# EAGLE design myStravaB_V2 (EAGLE 9.2.2)

## Sheet 1 of 5: MCU
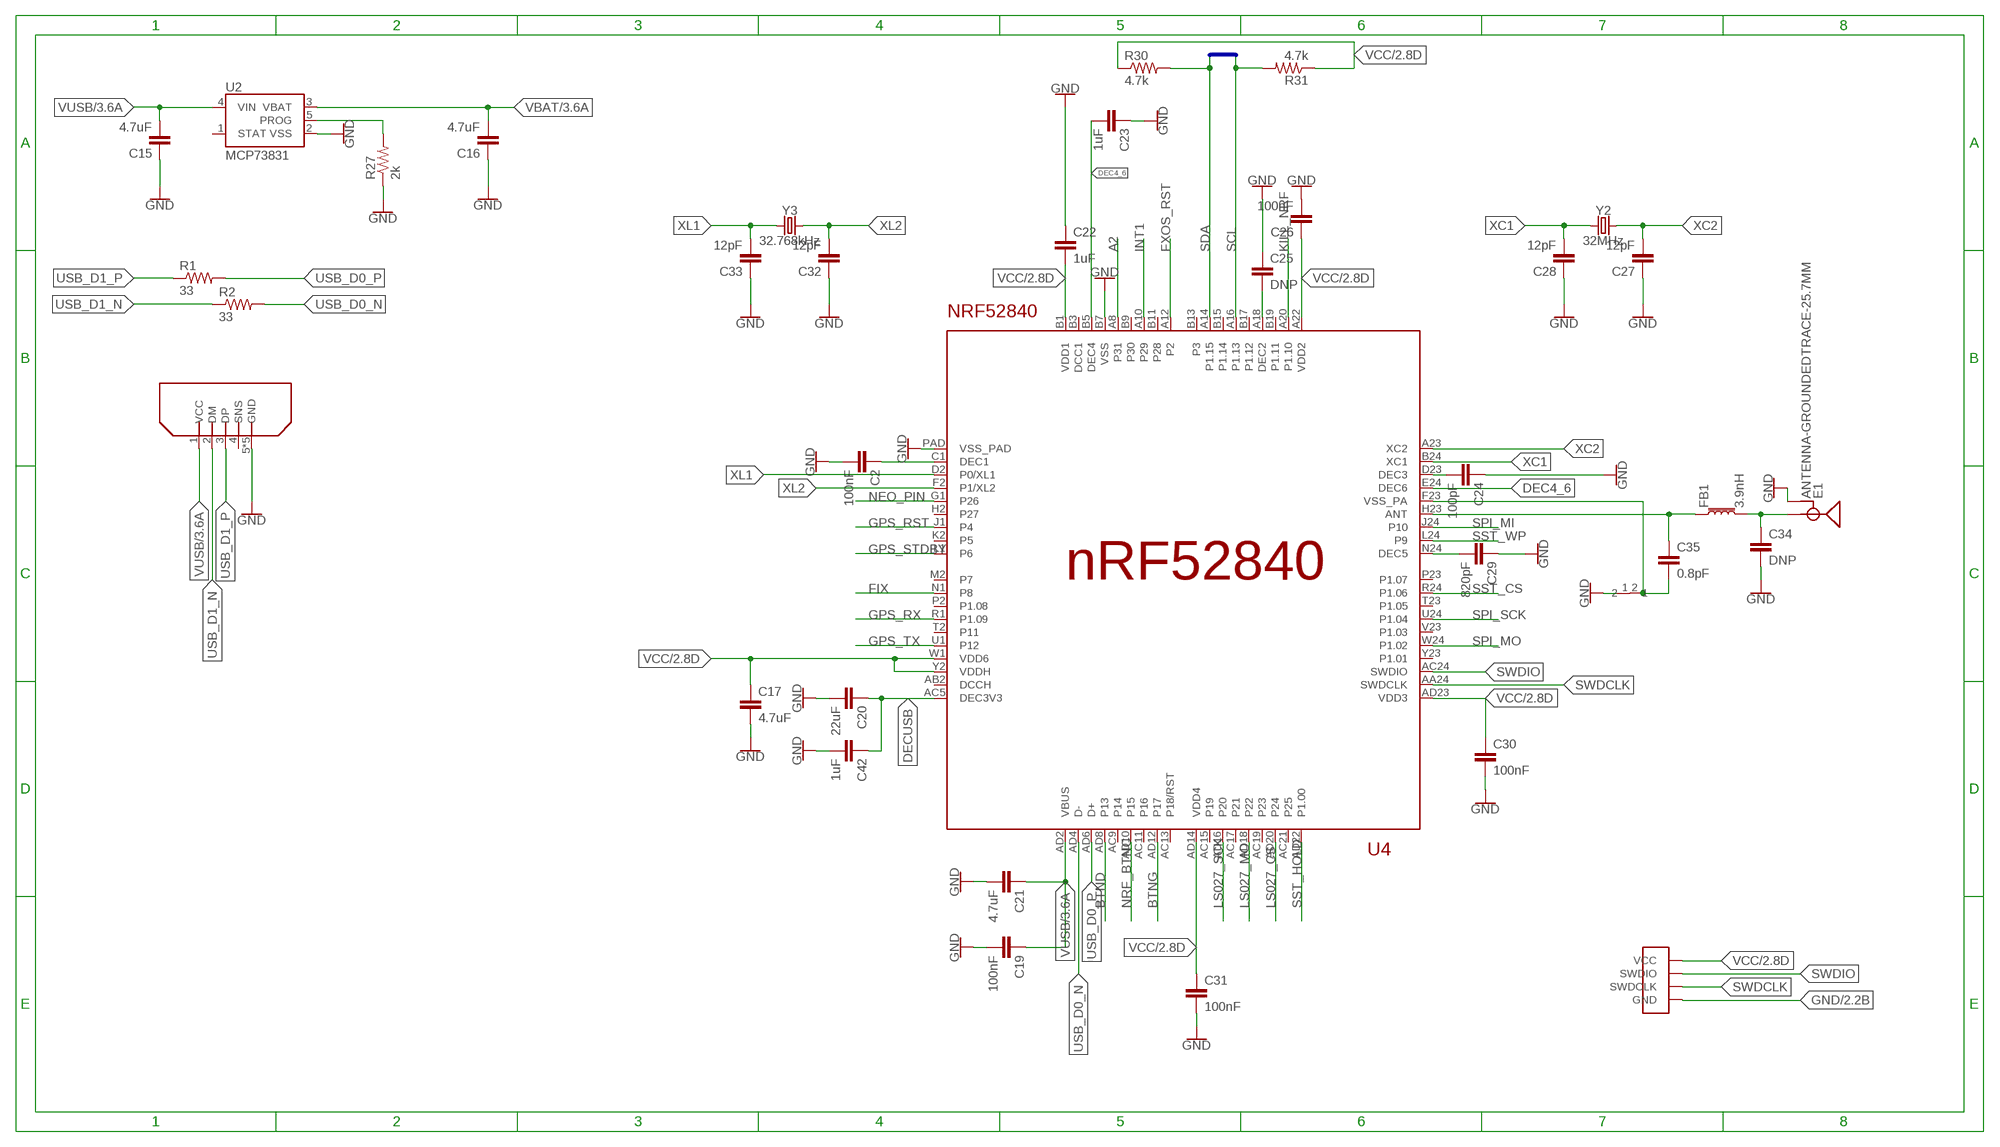
[diagram p0: schematic, sheet 1]

### Parts
C2  100nF  C-EUC0603  [C0603]
C15  4.7uF  C-EUC0805  [C0805]
C16  4.7uF  C-EUC0805  [C0805]
C17  4.7uF  C-EUC0603  [C0603]
C19  100nF  C-EUC0603  [C0603]
C20  22uF  C-EUC0603  [C0603]
C21  4.7uF  C-EUC0805  [C0805]
C22  1uF  4.7UF0603  [0603]
C23  1uF  4.7UF0603  [0603]
C24  100pF  C-EUC0603  [C0603]
C25  DNP  C-EUC0402  [C0402]
C26  100nF  C-EUC0603  [C0603]
C27  12pF  C-EUC0402  [C0402]
C28  12pF  C-EUC0402  [C0402]
C29  820pF  C-EUC0603  [C0603]
C30  100nF  C-EUC0402  [C0402]
C31  100nF  C-EUC0402  [C0402]
C32  12pF  C-EUC0603  [C0603]
C33  12pF  C-EUC0603  [C0603]
C34  DNP  4.7UF0603  [0603]
C35  0.8pF  C-EUC0402  [C0402]
C42  1uF  C-EUC0603  [C0603]
E1  ANTENNA-GROUNDEDTRACE-25.7MM  [TRACE_ANTENNA_2.4GHZ_25.7MM]
FB1  3.9nH  FERRITE_BEAD-0603  [0603]
R1  33  R-US_R0603  [R0603]
R2  33  R-US_R0603  [R0603]
R27  2k  R-US_R0603  [R0603]
R30  4.7k  R-US_R0603  [R0603]
R31  4.7k  R-US_R0603  [R0603]
U2  MCP73831  [SOT23-5]
U4  NRF52840  [AQFN73]
U$3  ZX80B5P  [ZX80B5P]
U$7  PROG_SMD  [PROG_SMD]
U$8  NET_CONN  [NET_CONN]
Y2  32MHz  CRYSTAL-16MHZSMD-5X3.2  [CRYSTAL-SMD-5X3.2-4PAD]
Y3  32.768kHz  CRYSTAL-32.768KHZSMD-3.2X1.5  [CRYSTAL-SMD-3.2X1.5MM]

### Nets
A2: U4.A8(P31)
BTND: U4.AD8(P13) ; also sheet 2
BTNG: U4.AD12(P17) ; also sheet 2
DEC1: C2.1 U4.C1(DEC1)
DEC2: C25.2 U4.A18(DEC2)
DEC3: C24.2 U4.D23(DEC3)
DEC4_6: C23.2 U4.B5(DEC4) U4.E24(DEC6)
DEC5: C29.2 U4.N24(DEC5)
DECUSB: C20.1 C42.1 U4.AC5(DEC3V3)
FIX: U4.N1(P8) ; also sheet 4
FXOS_RST: U4.A12(P2) ; also sheet 2
GND [power]: C2.2 C15.1 C16.1 C17.2 C19.2 C20.2 C21.2 C22.1 C23.1 C24.1 C25.1 C26.2 C27.1 C28.1 C29.1 C30.2 C31.2 C32.1 C33.1 C34.2 C42.2 E1.GND E1.GND2(GND) R27.1 U2.2(VSS) U4.B7(VSS) U4.PAD(VSS_PAD) U$3.5(GND) U$3.GND1(GND) U$3.GND2(GND) U$3.GND3(GND) U$3.GND4(GND) U$7.GND U$8.1 ; also sheet 2,3,4,5
GPS_RST: U4.J1(P4) ; also sheet 4
GPS_RX: U4.R1(P1.09) ; also sheet 4
GPS_STDBY: U4.L1(P6) ; also sheet 4
GPS_TX: U4.U1(P12) ; also sheet 4
INT1: U4.A10(P29) ; also sheet 2
KILL_NRF: U4.A20(P1.10) ; also sheet 3
LS027_CS: U4.AD20(P24) ; also sheet 5
LS027_MO: U4.AD18(P22) ; also sheet 5
LS027_SCK: U4.AD16(P20) ; also sheet 5
N$3 [RF]: C35.1 FB1.1 U4.H23(ANT)
N$7 [RF]: C34.1 E1.ANT(SIGNAL) FB1.2
N$10 [power]: C35.2 U4.F23(VSS_PA) U$8.2
N$13: R27.2 U2.5(PROG)
NEO_PIN: U4.G1(P26) ; also sheet 5
NRF_BTNC: U4.AD10(P15) ; also sheet 3
SCL: R31.2 U4.A16(P1.13) ; also sheet 2,3,5
SDA: R30.2 U4.A14(P1.15) ; also sheet 2,3,5
SPI_MI: U4.J24(P10) ; also sheet 2
SPI_MO: U4.W24(P1.02) ; also sheet 2
SPI_SCK: U4.U24(P1.04) ; also sheet 2
SST_CS: U4.R24(P1.06) ; also sheet 2
SST_HOLD: U4.AD22(P1.00) ; also sheet 2
SST_WP: U4.L24(P9) ; also sheet 2
SWDCLK: U4.AA24(SWDCLK) U$7.PIN1(SWDCLK)
SWDIO: U4.AC24(SWDIO) U$7.PIN2(SWDIO)
USB_D0_N [usb]: R2.2 U4.AD4(D-)
USB_D0_P [usb]: R1.2 U4.AD6(D+)
USB_D1_N [usb]: R2.1 U$3.2(DM)
USB_D1_P [usb]: R1.1 U$3.3(DP)
VBAT [power]: C16.2 U2.3(VBAT) ; also sheet 3,4
VCC [power]: C17.1 C22.2 C26.1 C30.1 C31.1 R30.1 R31.1 U4.A22(VDD2) U4.AD14(VDD4) U4.AD23(VDD3) U4.B1(VDD1) U4.W1(VDD6) U4.Y2(VDDH) U$7.VCC ; also sheet 2,3,4,5
VUSB [power]: C15.2 C19.1 C21.1 U2.4(VIN) U4.AD2(VBUS) U$3.1(VCC) ; also sheet 3
XC1: C28.2 U4.B24(XC1) Y2.1
XC2: C27.2 U4.A23(XC2) Y2.3
XL1: C33.2 U4.D2(P0/XL1) Y3.P$1
XL2: C32.2 U4.F2(P1/XL2) Y3.P$2
Unconnected: U2.1(STAT) U4.AB2(DCCH) U4.AC9(P14) U4.AC11(P16) U4.AC13(P18/RST) U4.AC15(P19) U4.AC17(P21) U4.AC19(P23) U4.AC21(P25) U4.B3(DCC1) U4.B9(P30) U4.B11(P28) U4.B13(P3) U4.B15(P1.14) U4.B17(P1.12) U4.B19(P1.11) U4.H2(P27) U4.K2(P5) U4.M2(P7) U4.P2(P1.08) U4.P23(P1.07) U4.T2(P11) U4.T23(P1.05) U4.V23(P1.03) U4.Y23(P1.01) U$3.4(SNS)

### Buses
SDA,SCL

## Sheet 2 of 5: Memory
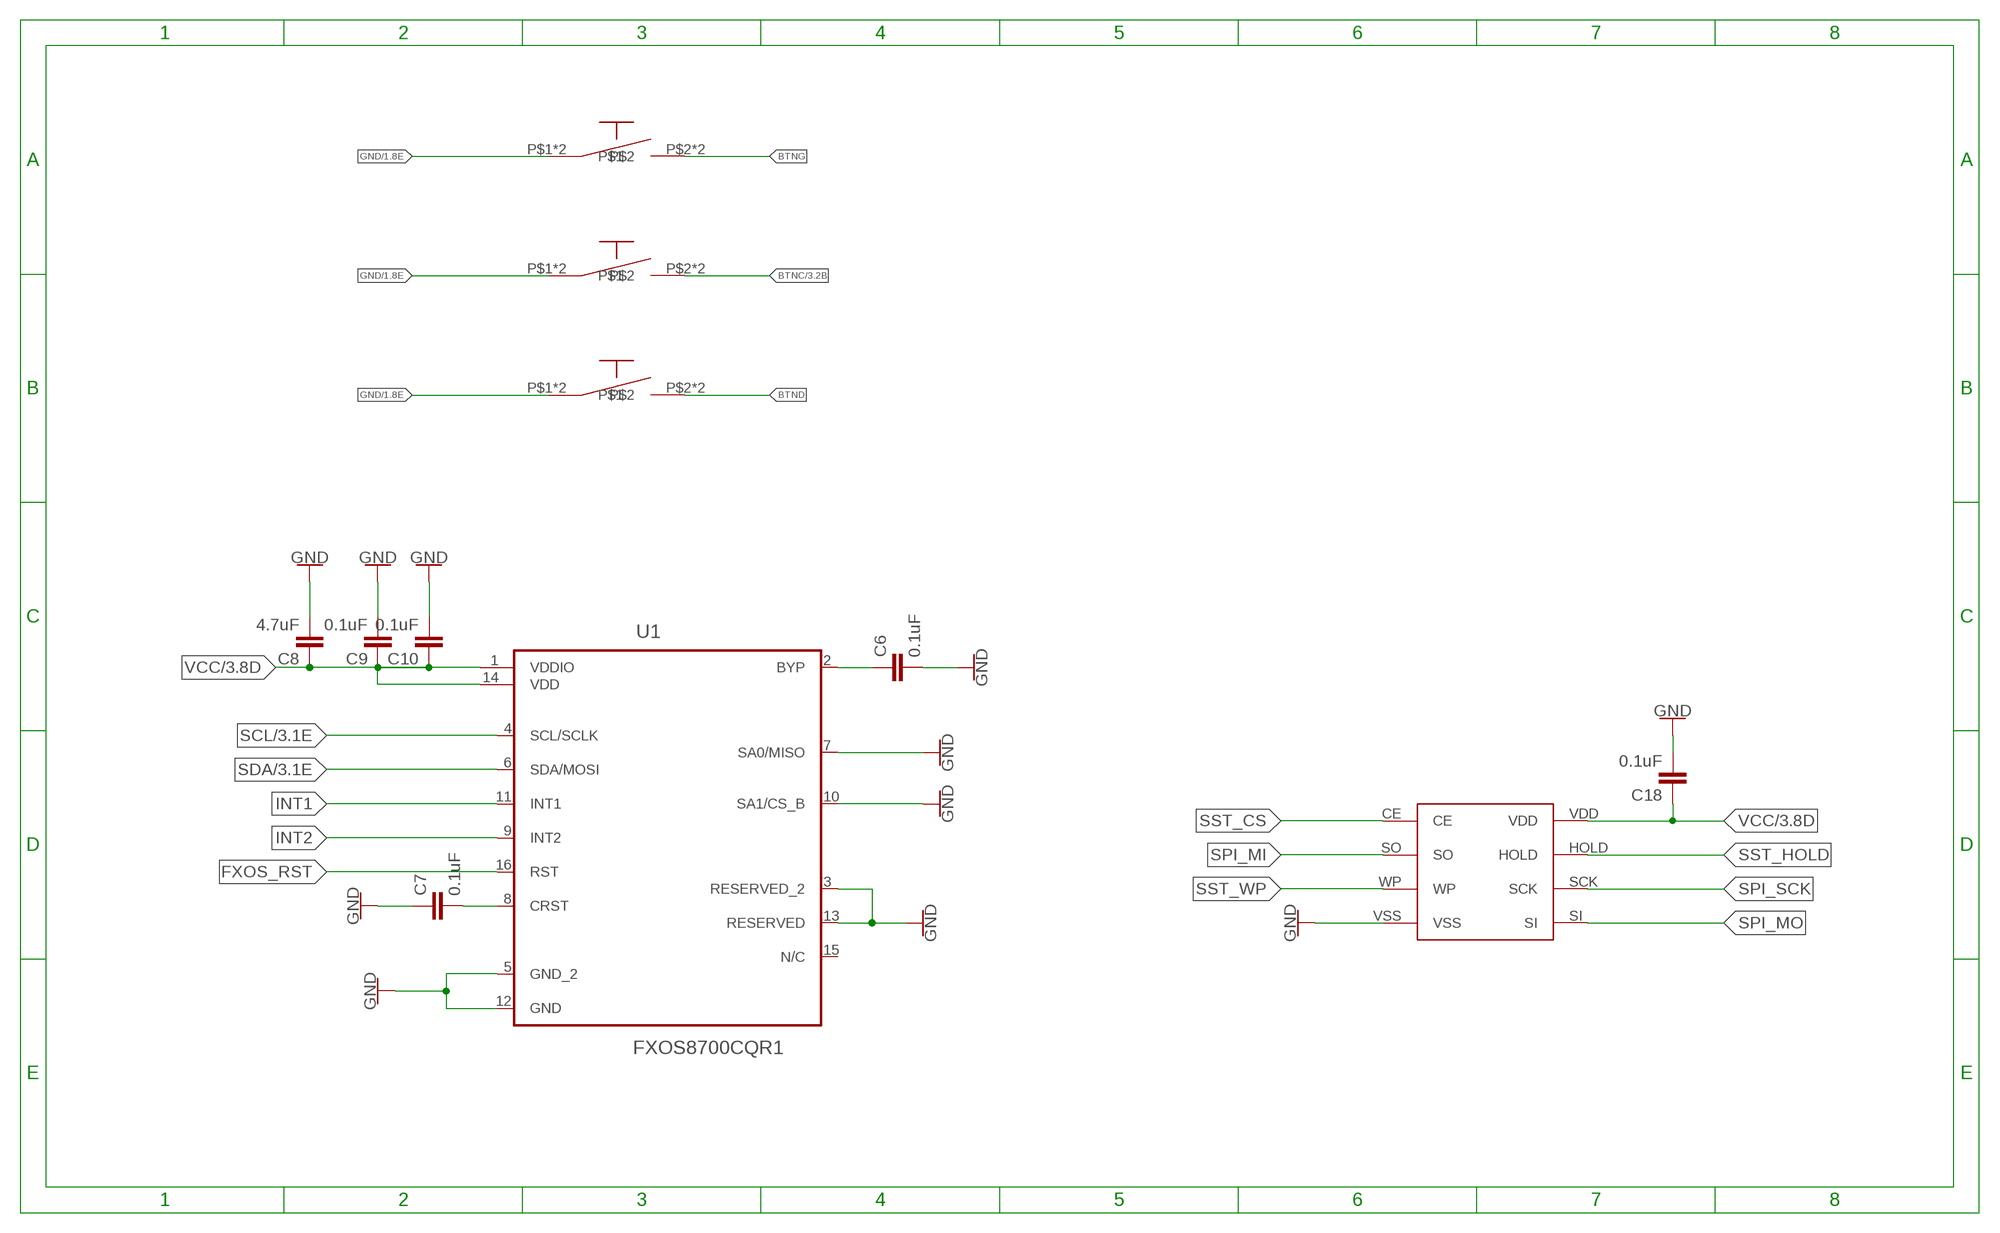
[diagram p1: schematic, sheet 2]

### Parts
BTNC1  SKRMAAE010  [SKRMAAE010]
BTND1  SKRMAAE010  [SKRMAAE010]
BTNG1  SKRMAAE010  [SKRMAAE010]
C6  0.1uF  4.7UF0603  [0603]
C7  0.1uF  4.7UF0603  [0603]
C8  4.7uF  4.7UF0603  [0603]
C9  0.1uF  4.7UF0603  [0603]
C10  0.1uF  4.7UF0603  [0603]
C18  0.1uF  4.7UF0603  [0603]
U1  FXOS8700CQR1  [QFN50P300X300X120-16N]
U$2  FLASH  [SOIC8]

### Nets
BTNC: BTNC1.P$2 BTNC1.P$4 ; also sheet 3
BTND: BTND1.P$2 BTND1.P$4 ; also sheet 1
BTNG: BTNG1.P$2 BTNG1.P$4 ; also sheet 1
BYP: C6.1 U1.2(BYP)
CRST: C7.2 U1.8(CRST)
FXOS_RST: U1.16(RST) ; also sheet 1
GND [power]: BTNC1.P$1 BTNC1.P$3 BTND1.P$1 BTND1.P$3 BTNG1.P$1 BTNG1.P$3 C6.2 C7.1 C8.2 C9.2 C10.2 C18.2 U1.3(RESERVED_2) U1.5(GND_2) U1.7(SA0/MISO) U1.10(SA1/CS_B) U1.12(GND) U1.13(RESERVED) U$2.VSS ; also sheet 1,3,4,5
INT1: U1.11(INT1) ; also sheet 1
INT2: U1.9(INT2)
SCL: U1.4(SCL/SCLK) ; also sheet 1,3,5
SDA: U1.6(SDA/MOSI) ; also sheet 1,3,5
SPI_MI: U$2.SO ; also sheet 1
SPI_MO: U$2.SI ; also sheet 1
SPI_SCK: U$2.SCK ; also sheet 1
SST_CS: U$2.CE ; also sheet 1
SST_HOLD: U$2.HOLD ; also sheet 1
SST_WP: U$2.WP ; also sheet 1
VCC [power]: C8.1 C9.1 C10.1 C18.1 U1.1(VDDIO) U1.14(VDD) U$2.VDD ; also sheet 1,3,4,5
Unconnected: U1.15(N/C)

## Sheet 3 of 5: Power
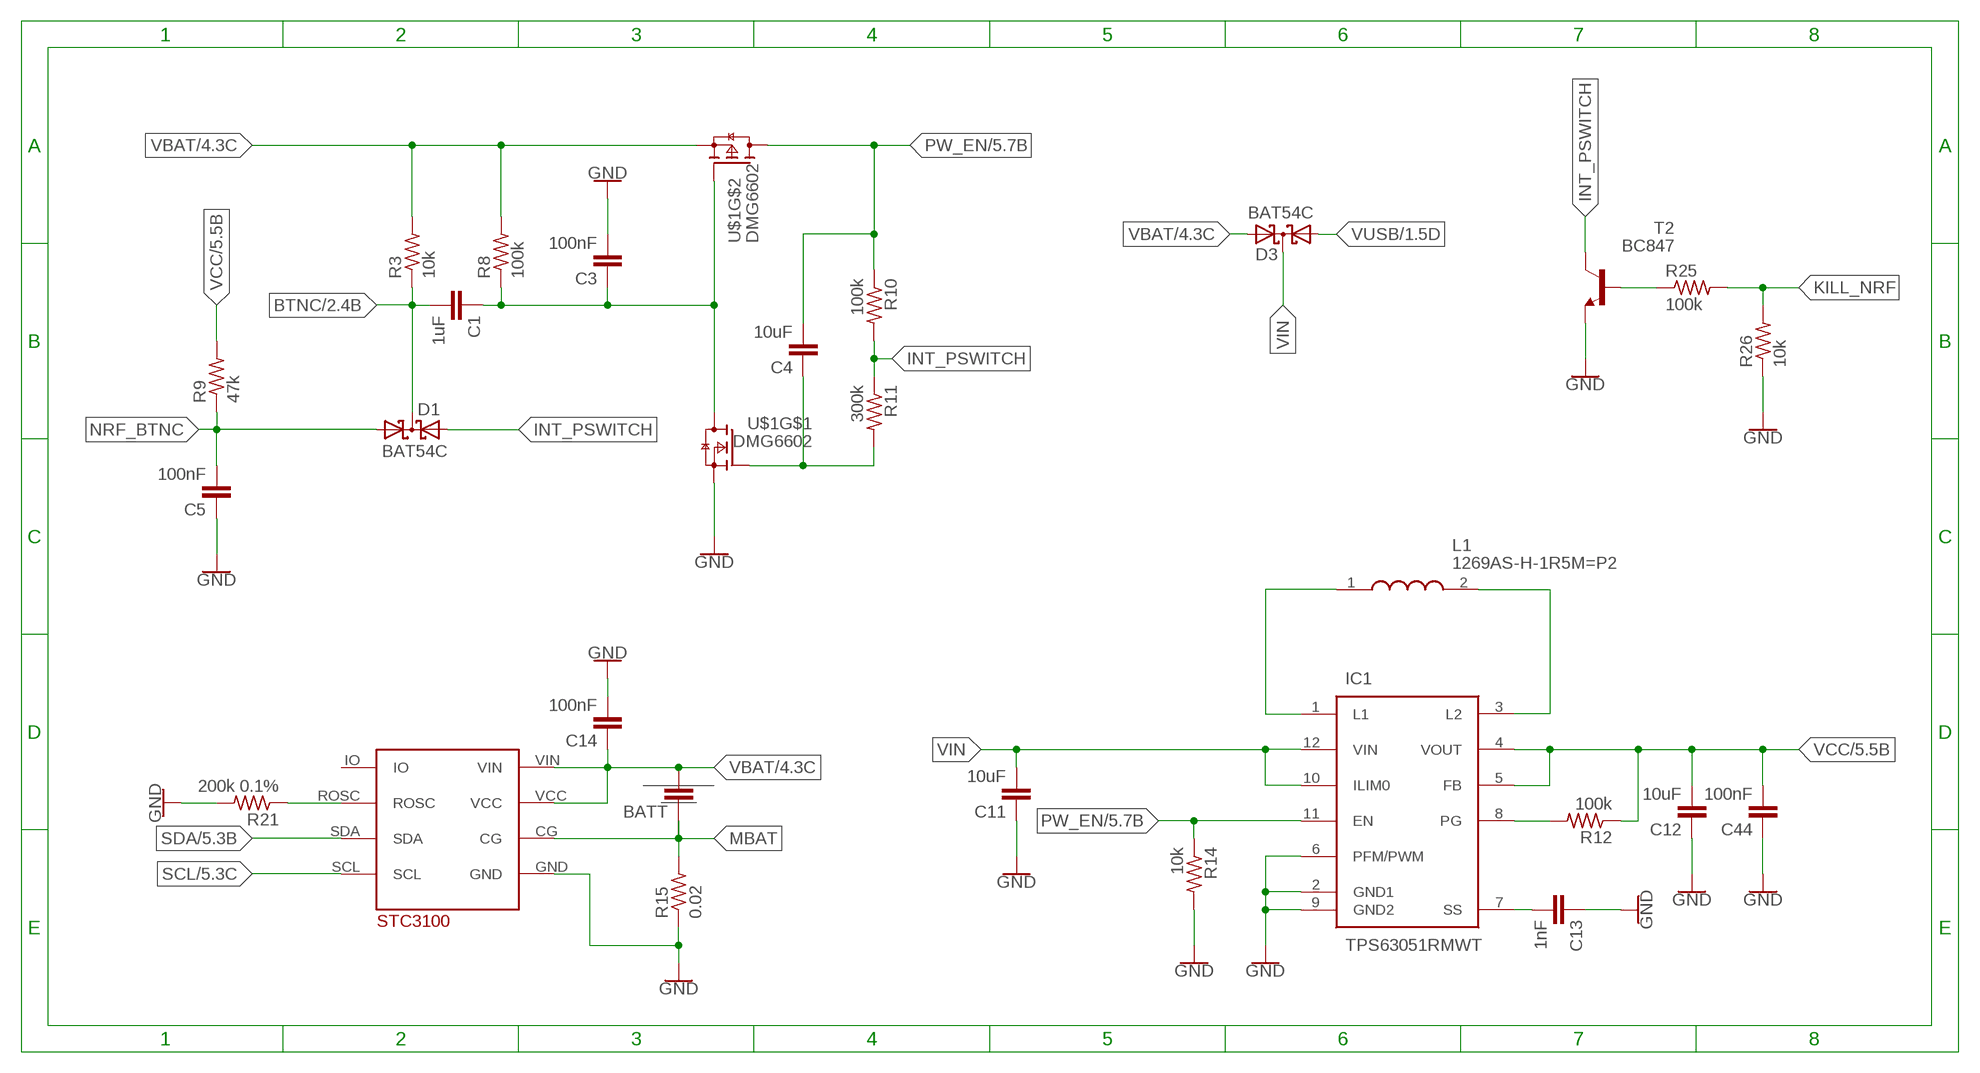
[diagram p2: schematic, sheet 3]

### Parts
BATT  C-EUC1210  [C1210]
C1  1uF  4.7UF0603  [0603]
C3  100nF  4.7UF0603  [0603]
C4  10uF  4.7UF0603  [0603]
C5  100nF  4.7UF0603  [0603]
C11  10uF  C-EUC0805  [C0805]
C12  10uF  C-EUC0603  [C0603]
C13  1nF  C-EUC0603  [C0603]
C14  100nF  C-EUC0603  [C0603]
C44  100nF  C-EUC0603  [C0603]
D1  BAT54C  [SOT23]
D3  BAT54C  [SOT23]
IC1  TPS63051RMWT  [QFN50P250X250X100-12N]
L1  1269AS-H-1R5M=P2  [INDC2520X110N]
R3  10k  R-US_R0603  [R0603]
R8  100k  R-US_R0603  [R0603]
R9  47k  R-US_R0603  [R0603]
R10  100k  R-US_R0603  [R0603]
R11  300k  R-US_R0603  [R0603]
R12  100k  R-US_R0603  [R0603]
R14  10k  R-US_R0603  [R0603]
R15  0.02  R-US_R0603  [R0603]
R21  200k 0.1%  R-US_R0603  [R0603]
R25  100k  R-US_R0603  [R0603]
R26  10k  R-US_R0603  [R0603]
T2  BC847  [SOT23]
U$1  DMG6602  [TSOT26]
U$6  STC3100  [STC3100]

### Nets
BTNC: C1.2 D1.3(CC) R3.1 ; also sheet 2
GND [power]: C3.2 C5.1 C11.1 C12.1 C13.1 C14.2 C44.1 IC1.2(GND1) IC1.6(PFM/PWM) IC1.9(GND2) R14.2 R15.1 R21.2 R26.1 T2.2(E) U$1.P$5(S) U$6.GND ; also sheet 1,2,4,5
INT_PSWITCH: D1.2(A2) R10.2 R11.1 T2.3(C)
KILL_NRF: R25.2 R26.2 ; also sheet 1
L1: IC1.1(L1) L1.1
L2: IC1.3(L2) L1.2
MBAT: BATT.1 R15.2 U$6.CG
N$9: C1.1 C3.1 R8.1 U$1.P$3(G) U$1.P$6(D)
N$12: R25.1 T2.1(B)
N$15: C4.1 R11.2 U$1.P$1(G)
NRF_BTNC: C5.2 D1.1(A1) R9.1 ; also sheet 1
PG: IC1.8(PG) R12.2
PW_EN: C4.2 IC1.11(EN) R10.1 R14.1 U$1.P$4(D) ; also sheet 5
ROSC: R21.1 U$6.ROSC
SCL: U$6.SCL ; also sheet 1,2,5
SDA: U$6.SDA ; also sheet 1,2,5
SS: C13.2 IC1.7(SS)
VBAT [power]: BATT.2 C14.1 D3.2(A2) R3.2 R8.2 U$1.P$2(S) U$6.VCC U$6.VIN ; also sheet 1,4
VCC [power]: C12.2 C44.2 IC1.4(VOUT) IC1.5(FB) R9.2 R12.1 ; also sheet 1,2,4,5
VIN: C11.2 D3.3(CC) IC1.10(ILIM0) IC1.12(VIN)
VUSB [power]: D3.1(A1) ; also sheet 1
Unconnected: U$6.IO

## Sheet 4 of 5: GPS
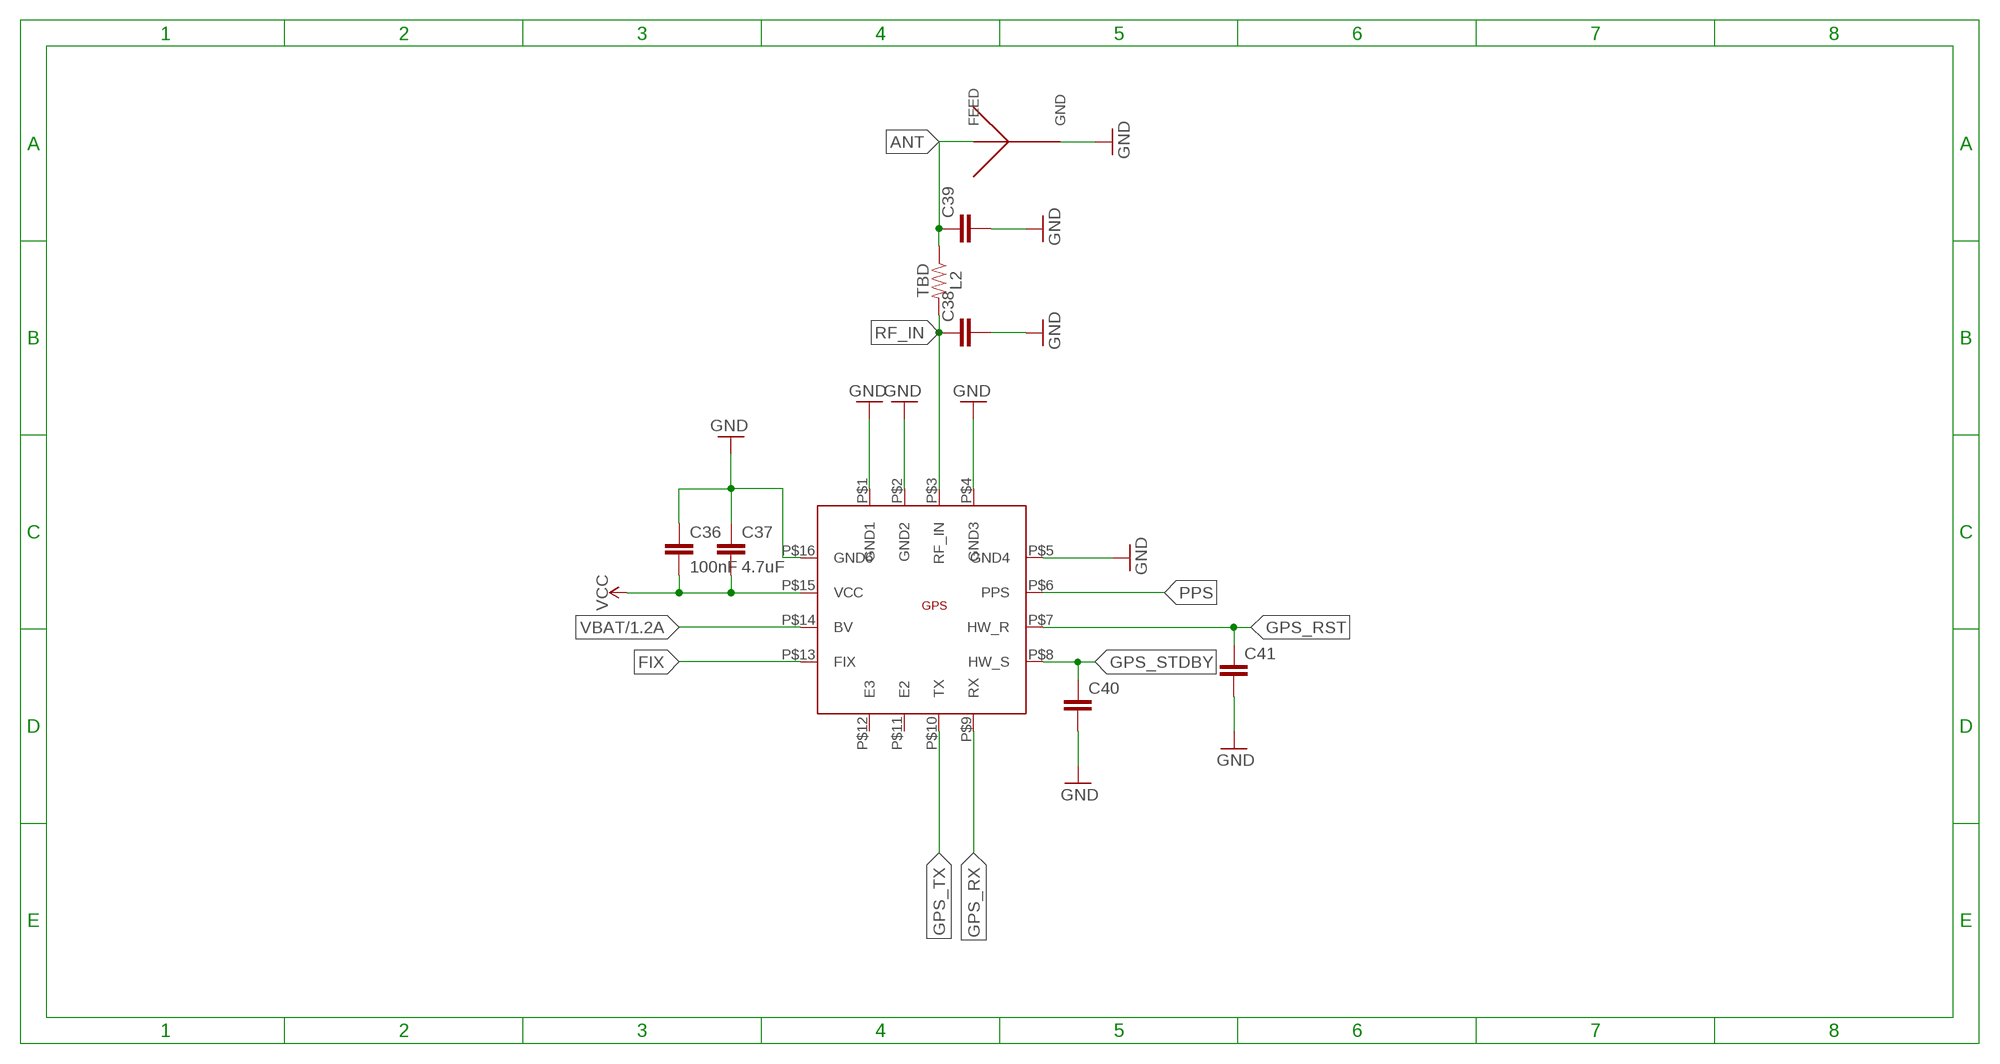
[diagram p3: schematic, sheet 4]

### Parts
C36  100nF  C-EUC0603  [C0603]
C37  4.7uF  C-EUC0603  [C0603]
C38  C-EUC0603  [C0603]
C39  C-EUC0603  [C0603]
C40  C-EUC0603  [C0603]
C41  C-EUC0603  [C0603]
L2  TBD  4.7KOHM-0603-1/10W-1%  [0603]
U$4  SR4G008  [SR4G008]
U$5  M10578  [M10578]

### Nets
ANT [RF]: C39.1 L2.1 U$4.P$2(FEED)
FIX: U$5.P$13(FIX) ; also sheet 1
GND [power]: C36.1 C37.1 C38.2 C39.2 C40.2 C41.2 U$4.P$3(GND) U$4.P$4(GND) U$4.P$6(GND) U$5.P$1(GND1) U$5.P$2(GND2) U$5.P$4(GND3) U$5.P$5(GND4) U$5.P$16(GND6) ; also sheet 1,2,3,5
GPS_RST: C41.1 U$5.P$7(HW_R) ; also sheet 1
GPS_RX: U$5.P$9(RX) ; also sheet 1
GPS_STDBY: C40.1 U$5.P$8(HW_S) ; also sheet 1
GPS_TX: U$5.P$10(TX) ; also sheet 1
PPS: U$5.P$6(PPS)
RF_IN [RF]: C38.1 L2.2 U$5.P$3(RF_IN)
VBAT [power]: U$5.P$14(BV) ; also sheet 1,3
VCC [power]: C36.2 C37.2 U$5.P$15(VCC) ; also sheet 1,2,3,5
Unconnected: U$5.P$11(E2) U$5.P$12(E3)

## Sheet 5 of 5: Sensors
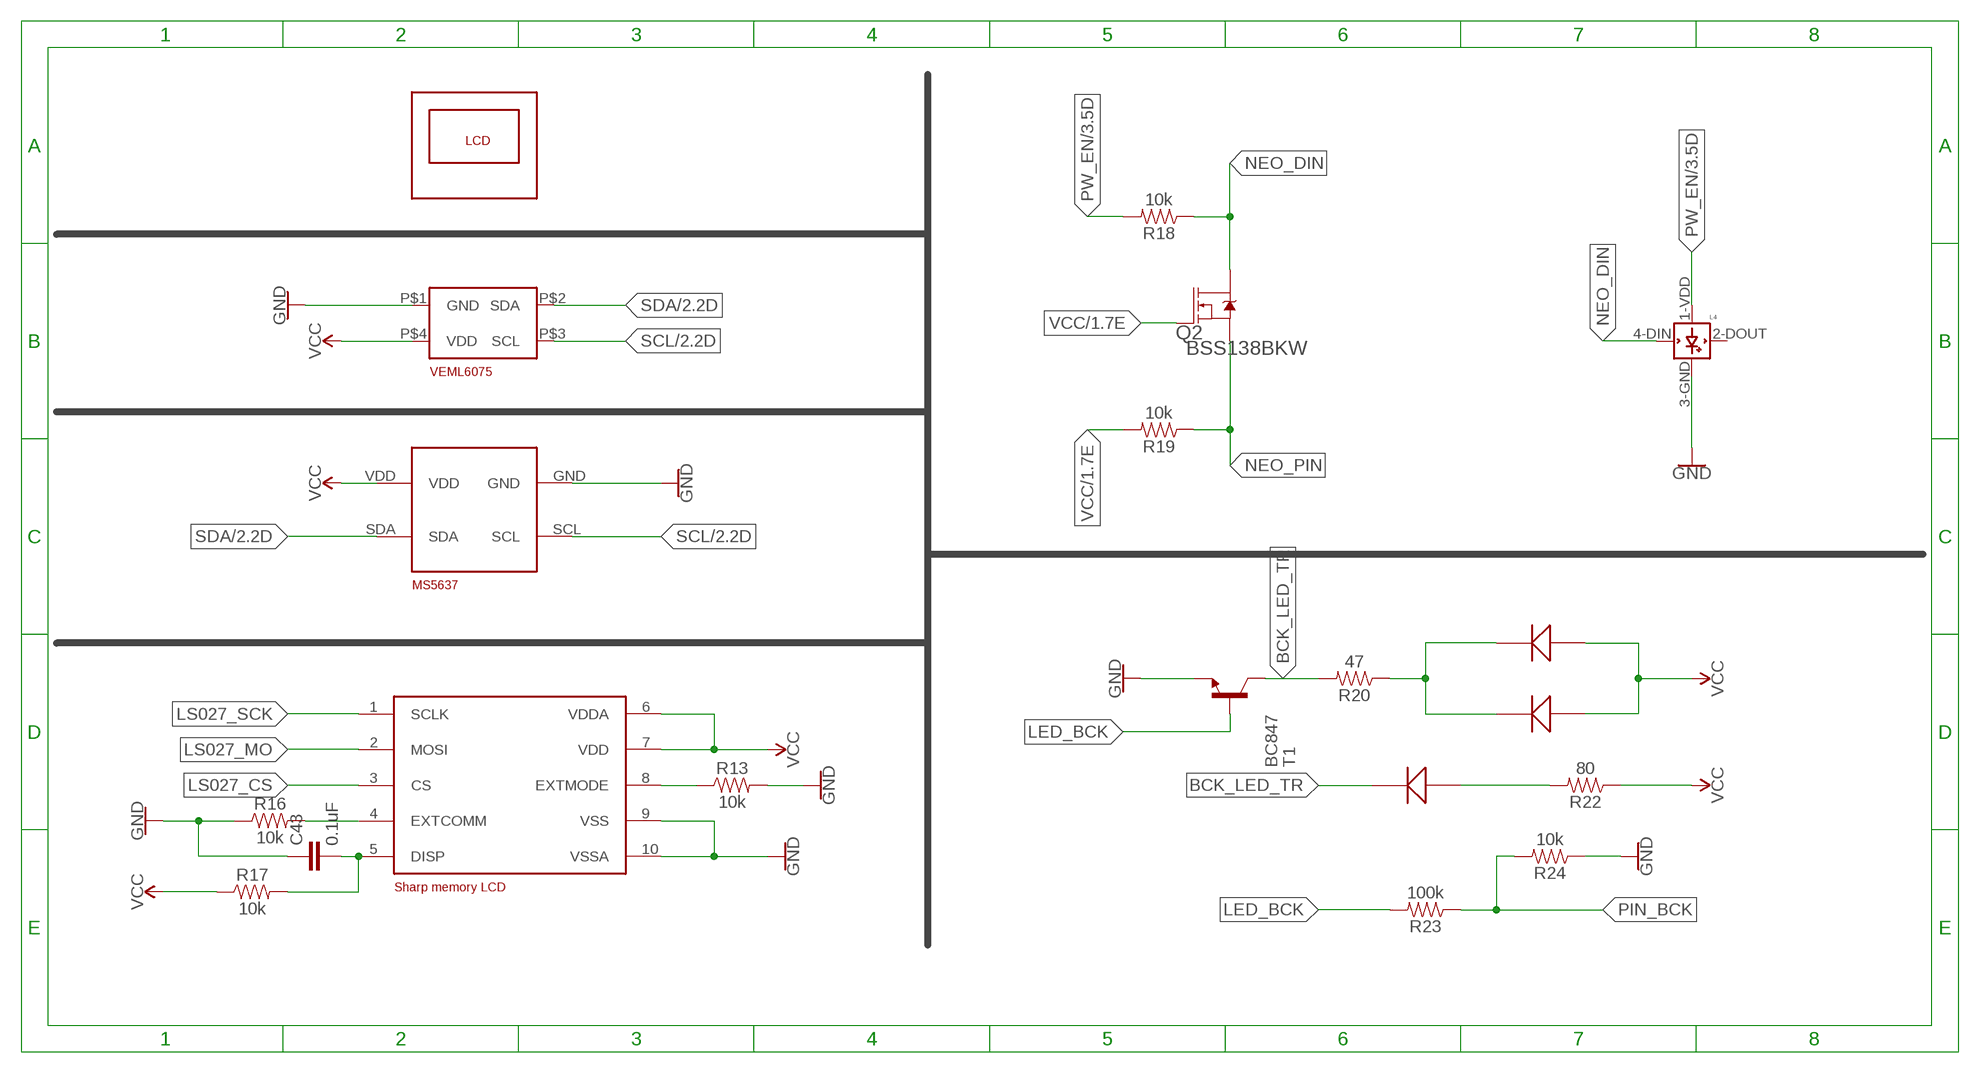
[diagram p4: schematic, sheet 5]

### Parts
C43  0.1uF  0.1UF-0603-25V-(+80/-20%)  [0603]
L4  WS2812B  [WS2812B]
MS1  MS5637  [MS5637]
Q2  BSS138BKW  [SOT65P210X110-3N]
R13  10k  4.7KOHM-0603-1/10W-1%  [0603]
R16  10k  4.7KOHM-0603-1/10W-1%  [0603]
R17  10k  4.7KOHM-0603-1/10W-1%  [0603]
R18  10k  4.7KOHM-0603-1/10W-1%  [0603]
R19  10k  4.7KOHM-0603-1/10W-1%  [0603]
R20  47  4.7KOHM-0603-1/10W-1%  [0603]
R22  80  4.7KOHM-0603-1/10W-1%  [0603]
R23  100k  4.7KOHM-0603-1/10W-1%  [0603]
R24  10k  4.7KOHM-0603-1/10W-1%  [0603]
T1  BC847  [SOT23]
U$14  VEML6075  [VEML6075]
U$15  SHARP27_FOOTPRINT  [LCD27]
U$16  SHARP27  [SHARP27]
U$17  KPA-2106SECK  [KPA-2106SECK]
U$18  KPA-2106SECK  [KPA-2106SECK]
U$19  KPA-2106SECK  [KPA-2106SECK]

### Nets
BCK_LED_TR [power]: R20.2 T1.3(C) U$19.P$1
DISP1: C43.2 R17.2 U$16.5(DISP)
EXTCOMM1: R16.2 U$16.4(EXTCOMM)
EXTMODE1: R13.1 U$16.8(EXTMODE)
GND [power]: C43.1 L4.3-GND(GND) MS1.GND R13.2 R16.1 R24.1 T1.2(E) U$14.P$1(GND) U$16.9(VSS) U$16.10(VSSA) ; also sheet 1,2,3,4
LED_BCK: R23.2 T1.1(B)
LS027_CS: U$16.3(CS) ; also sheet 1
LS027_MO: U$16.2(MOSI) ; also sheet 1
LS027_SCK: U$16.1(SCLK) ; also sheet 1
N$16 [power]: R22.2 U$19.P$2
N$17: R20.1 U$17.P$1 U$18.P$1
NEO_DIN: L4.4-DIN(DIN) Q2.3(D) R18.1
NEO_PIN: Q2.2(S) R19.1 ; also sheet 1
PIN_BCK: R23.1 R24.2
PW_EN: L4.1-VDD(VDD) R18.2 ; also sheet 3
SCL: MS1.SCL U$14.P$3(SCL) ; also sheet 1,2,3
SDA: MS1.SDA U$14.P$2(SDA) ; also sheet 1,2,3
VCC [power]: MS1.VDD Q2.1(G) R17.1 R19.2 R22.1 U$14.P$4(VDD) U$16.6(VDDA) U$16.7(VDD) U$17.P$2 U$18.P$2 ; also sheet 1,2,3,4
Unconnected: L4.2-DOUT(DOUT)

## Library data of the parts
BATT C11-C14 C17 C19-C21 C36-C42 C44 = rcl:C-EU: CAPACITOR, European symbol; SPICEPREFIX: C
BTNC1 BTND1 BTNG1 = SPST:SKRMAAE010: Tactile Switches 4.5x4.5x0.4mm 160gf
C1 C3-C7 C9 C10 C18 C22 C23 C34 = SparkFun-Capacitors:4.7UF: 4.7µF ceramic capacitors A capacitor is a passive two-terminal electrical component used to store electrical energy temporarily in an electric field.; PROD_ID: CAP-08280; VALUE: 4.7uF
C2 C15 C16 C24-C33 C35 = rcl:C-EU: CAPACITOR, European symbol
C8 = SparkFun-Capacitors:4.7UF: 4.7µF ceramic capacitors A capacitor is a passive two-terminal electrical component used to store electrical energy temporarily in an electric field.; PROD_ID: CAP-08280
C43 = SparkFun-Capacitors:0.1UF: 0.1µF ceramic capacitors A capacitor is a passive two-terminal electrical component used to store electrical energy temporarily in an electric field.; PROD_ID: CAP-00810
D1 D3 = diode:BAT54C: Schottky Diodes Source: Fairchild .. BAT54.pdf
E1 = SparkFun-RF:ANTENNA-GROUNDED: Antenna w/ Ground Connection 2.4GHz antennae with signal and ground terminals. TRACE_ANTENNA_2.4GHZ_15.2MM - Meander Trace antenna 15.2 x 5.7mm footprint Based on layout from TI app note AN043 <http://www.ti.com/lit/an/swra117d/swra117d.pdf>. TRACE_ANTENNA_2.4GHZ_25.7MM - Inverted F trace antenna 25.7 x 7.5 mm footprint. Based on layout from TI design note DN0007 <http://www.ti.com/lit/an/swru120b/swru120b.pdf>.
FB1 = SparkFun-Coils:FERRITE_BEAD: Ferrite Bead (blocks, cores, rings, chokes, etc.) Inductor with layers of ferrite used to suppress high frequencies. Often used to isolate high frequency noise. SparkFun Products: IOIO-OTG - V2.2 <https://www.sparkfun.com/products/13613> SparkFun SAMD21 Mini Breakout <https://www.sparkfun.com/products/13664> SparkFun 6 Degrees of Freedom Breakout - LSM6DS3 <https://www.sparkfun.com/products/13339> SparkFun SAMD21 Dev Breakout <https://www.sparkfun.com/products/13672>; PROD_ID: NDUC-07859; VALUE: 30Ω/1.8A
IC1 = SamacSys_Parts:TPS63051RMWT: Switching Voltage Regulators Tiny Single Ind Buck Boost Convter Source: Datasheet <http://www.ti.com/general/docs/lit/getliterature.tsp?genericPartNumber=TPS63051&&fileType=pdf>; ARROW_PART_NUMBER: TPS63051RMWT; ARROW_PRICE/STOCK: https://www.arrow.com/en/products/tps63051rmwt/texas-instruments; DESCRIPTION: Switching Voltage Regulators Tiny Single Ind Buck Boost Convter; HEIGHT: 1mm; MANUFACTURER_NAME: Texas Instruments; MANUFACTURER_PART_NUMBER: TPS63051RMWT; RS_PART_NUMBER: 1330763; RS_PRICE/STOCK: http://uk.rs-online.com/web/p/products/1330763
L1 = SamacSys_Parts:1269AS-H-1R5M=P2: Fixed Inductors 1.5uH 108mOhms2.1A +/-20% 2.5x2.0x1.0mm Source: Datasheet <https://componentsearchengine.com/Datasheets/1/1269AS-H-1R5M=P2.pdf>; ARROW_PART_NUMBER: 1269AS-H-1R5M=P2; ARROW_PRICE/STOCK: https://www.arrow.com/en/products/1269as-h-1r5mp2/murata-manufacturing; DESCRIPTION: Fixed Inductors 1.5uH 108mOhms2.1A +/-20% 2.5x2.0x1.0mm; HEIGHT: 1.1mm; MANUFACTURER_NAME: Murata Electronics; MANUFACTURER_PART_NUMBER: 1269AS-H-1R5M=P2
L2 R13 R16-R20 R22-R24 = SparkFun-Resistors:4.7KOHM: 4.7kΩ resistor A resistor is a passive two-terminal electrical component that implements electrical resistance as a circuit element. Resistors act to reduce current flow, and, at the same time, act to lower voltage levels within circuits. - Wikipedia; PROD_ID: RES-07857; VALUE: 4.7k
L4 = adafruit:WS2812B
MS1 = MS5637:MS5637: Le MS563702BA03-50 est un Micro Altimètre ultra compact optimisé pour des applications d'altimètre et de baromètre dans des téléphones portables et des tablettes. La résolution d'altitude au niveau de la mer est de 13cm d'air. Le module de capteur comprend un capteur de pression haute linéarité et un CAN ΔΣ 24 bits ultra faible puissance avec des coefficients internes calibrés en usine. Il fournit une valeur numérique de pression et de température précise de 24 bits et différents modes de fonctionnement qui permettent à l'utilisateur d'optimiser la vitesse de conversion et la consommation de courant. La sortie de température à haute résolution permet la mise en œuvre d'une fonction altimètre / thermomètre sans capteur supplémentaire. Il peut être interfacé avec pratiquement tous les microcontrôleurs à interface I²C-bus. Le protocole de communication est simple, sans avoir à programmer des registres internes dans l'appareil. Faibles dimensions de 3 x 3 x 0.9mm³ pour une intégratio Module haute résolution, 13cm Capteur de pression numérique intégré (CAN ΔΣ 24 bits) Interface I²C Plage de pression étendue de 10 à 2000mbar Conversion rapide jusqu'à 0.5ms Faible consommation, 0.6µA (veille <=0.1µA à 25°C) Aucun composant externe (oscillateur interne)
Q2 = BSS138:BSS138BKW: N-channel Trench MOSFET; MPN: BSS138BKW; OC_FARNELL: 2053836; OC_NEWARK: 61T7488; PACKAGE: SOT-23-3; SUPPLIER: NXP
R1-R3 R8-R12 R14 R15 R21 R25-R27 R30 R31 = rcl:R-US_: RESISTOR, American symbol; SPICEPREFIX: R
T1 T2 = nxp_60:BC847: 45 V, 100 mA NPN general-purpose transistors NPN general-purpose transistor AAL Eindhoven MK
U1 = FXOS8700CQR1:FXOS8700CQR1: ACCELEROMETER, MEMS, 6-AXIS, DIGITAL OUTPUT,QFN-16; MPN: FXOS8700CQR1; OC_FARNELL: Unknown; OC_NEWARK: 47W8598; PACKAGE: QFN-16; SUPPLIER: FREESCALE SEMICONDUCTOR
U2 = SparkFun-IC-Power:MCP73831: MCP73831T Li-Ion, Li-Pol Controller Miniature single cell, fully integrated Li-Ion, Li-polymer charge management controller Datasheet <http://ww1.microchip.com/downloads/en/DeviceDoc/20001984g.pdf> SparkFun Products: SparkFun ESP32 Thing <https://www.sparkfun.com/products/13907> SparkFun 9DoF Razor IMU M0 <https://www.sparkfun.com/products/14001>; PROD_ID: IC-09995
U4 = nRF52840:NRF52840; SPICEPREFIX: X
U$1 = nxp_60:DMG6602: This new generation MOSFET is designed to minimize the on-state resistance (RDS(on)) and yet maintain superior switching performance, making it ideal for high efficiency power management applications. - Backlighting - DC-DC Converters - Power Management Functions; MPN: DMG6602SVTQ
U$2 = FlashMem:FLASH
U$3 = USB:ZX80B5P
U$4 = SR4G008:SR4G008: Antenna for 1559 – 1609 MHz, GNSS for embedded applications  Solution for all global public constellations: GPS, GLONASS, Beidou and GALILEO.  Maintains high performance on device: DFI (Designed For Integration)  Ultra flat compact design of only 0.4mm thickness.  Designed for SMD mounting  Supplied on Tape and Reel
U$5 = M10578:M10578: Simple drop in solution full GNSS receiver (GPS/GLONASS/GALILEO/BEIDOU) • MediaTek MT3333 flash chip • Ultra-small SMD package; 9.0 x 9.0 x 1.8mm • Low current consumption • AIC, Active Interference Cancellation • EASY - Internally generated orbit prediction for fast fix times.
U$6 = STC3100:STC3100: The STC3100 monitors the critical parameters of a single-cell Li-Ion battery (voltage, temperature and current) and includes hardware functions to implement a gas gauge for battery charge monitoring, based on a programmable 12- to 14-bit A/D converter. With a typical 30 milliOhms external sense resistor, the battery current can be up to 2.5 A and the accumulator system provides a capacity up to +/-7000 mAh with a resolution of 0.2 mAh. The device is programmable through the I2C interface.
U$7 = Prog:PROG_SMD
U$8 = NET_CONN:NET_CONN: Net connector
U$14 = VEML6075:VEML6075: The VEML6075 senses UVA and UVB light and incorporates photodiode, amplifiers, and analog / digital circuits into a single chip using a CMOS process. When the UV sensor is applied, it is able to detect UVA and UVB intensity to provide a measure of the signal strength as well as allowing for UVI measurement.
U$15 = sharp:SHARP27_FOOTPRINT
U$16 = sharp:SHARP27: Sharp memory LCD LS027B7DH01
U$17-U$19 = KPA_LED:KPA-2106SECK: LED, Angle Droit, Orange, CMS, 20 mA, 2.1 V, 601 nm
Y2 = Sparkfun-clocks:CRYSTAL-16MHZ: 16MHz Crystal Digikey Example <http://www.digikey.com/product-search/en?keywords=535-9122-1-ND> Frequency: 16MHz Frequency Stability: ±50ppm Frequency Tolerance: ±20ppm Load Capacitance: 18pF SparkFun Products: Pro Micro -5V/16MHz <https://www.sparkfun.com/products/12640> SparkFun Serial Enabled LCD Kit <https://www.sparkfun.com/products/10097>; PROD_ID: XTAL-08218; SF_ID: COM-00094; VALUE: 16MHz
Y3 = Sparkfun-clocks:CRYSTAL-32.768KHZ: 32.768kHz Crystal Frequency: 32.768kHz Frequency Stability: ±20ppm Load Capacitance: 12.5pF (PTH-2X6 & SMD-3.2X1.5), 6pF (SMD-2X6) SparkFun Products: SparkFun BigTime Watch Kit <https://www.sparkfun.com/products/11734> SparkFun nRF52832 Breakout <https://www.sparkfun.com/products/13990> SparkFun Real Time Clock Module <https://www.sparkfun.com/products/12708>; PROD_ID: XTAL-13062

## Net classes
0 default: width 0.152 mm, drill 0.254 mm, clearance 0.178 mm
1 power: width 0.229 mm, drill 0.203 mm, clearance 0.152 mm to class 0, clearance 0.203 mm
2 RF: width 0.762 mm, drill 0.305 mm, clearance 0.152 mm to class 0, clearance 0.152 mm to class 1, clearance 0.152 mm
3 usb: width 0.305 mm, drill 0.305 mm, clearance 0.508 mm to class 0, clearance 0.152 mm to class 1, clearance 0.508 mm to class 2, clearance 0.152 mm

## Board
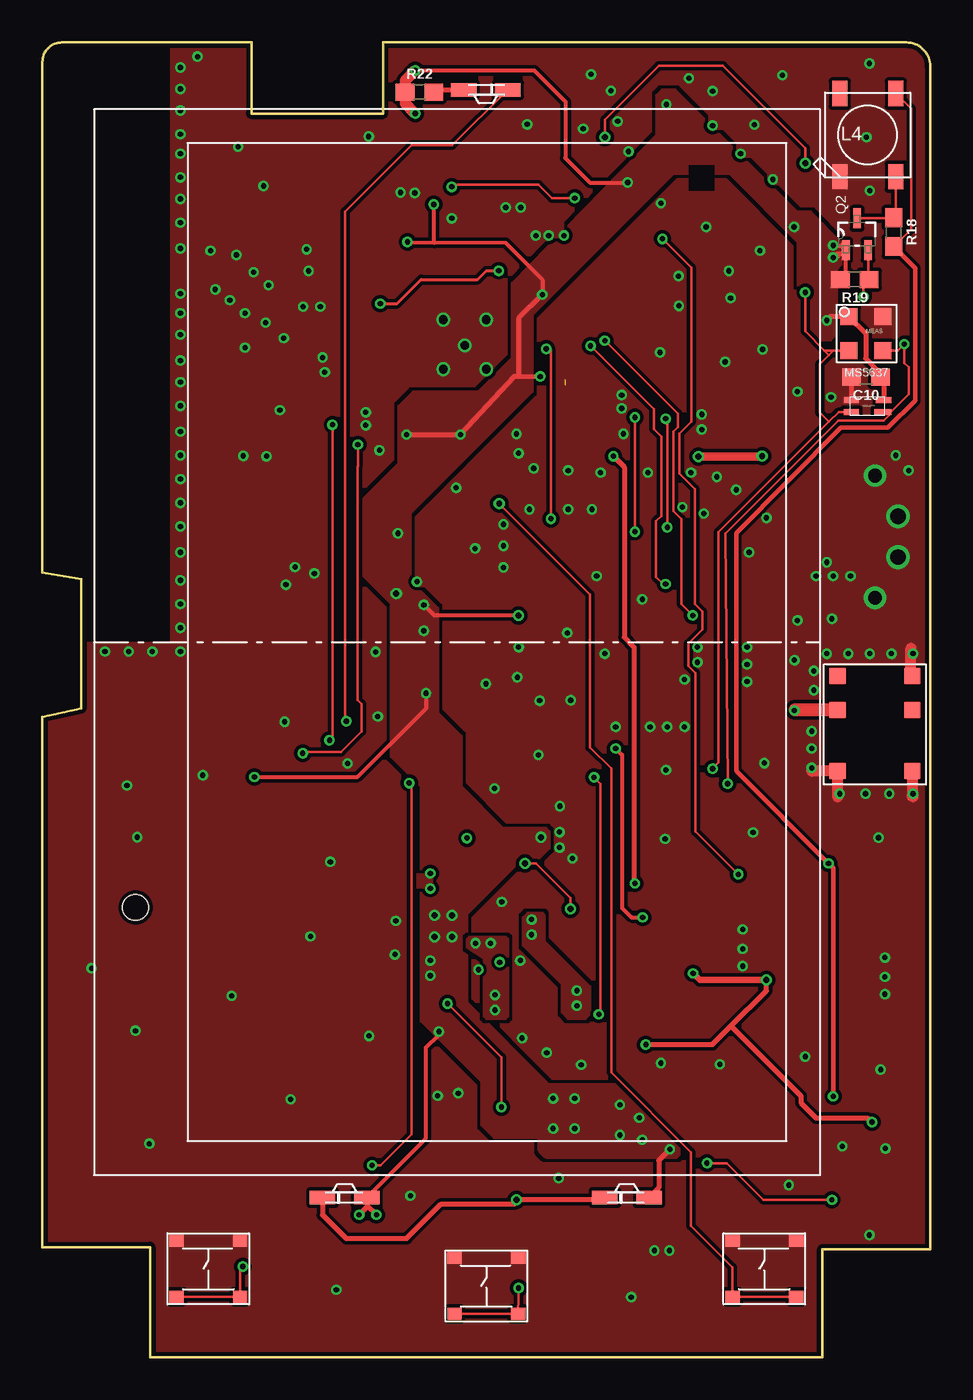
[diagram p5: board, top side]
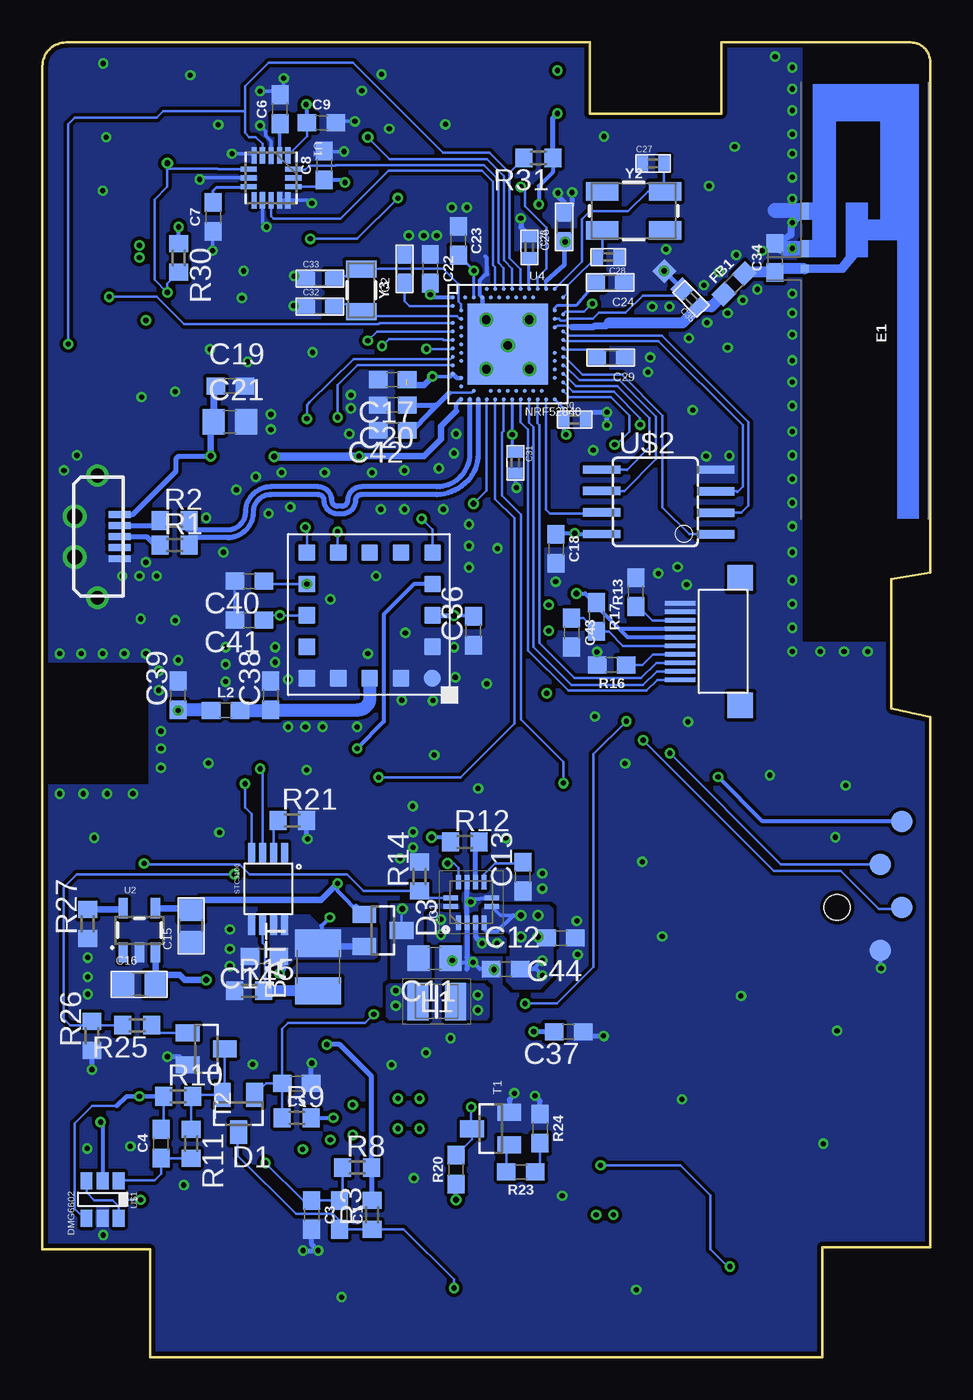
[diagram p6: board, bottom side, seen from below]

Size 52.32 x 77.47 mm. Coordinates in mm from the lower left corner, seen from the top.
Outline: 0,76.33 0,46.23 2.29,45.85 2.29,38.23 0,37.72 0,6.48 6.35,6.48 6.35,0 45.97,0 45.97,6.35 52.32,6.35 52.32,76.07 arc90 50.93,77.47 20.07,77.47 20.07,73.28 12.32,73.28 12.32,77.47 1.14,77.47 arc90 0,76.33
Copper layers (1*16): Top 0.035mm / dielectric 0.7mm / Bottom 0.035mm
Design rules "SeeedStudio_2layer_DRU_no_angle_20140221 *": minimum track width 6mil, minimum drill 12mil, track to track 6mil, track to pad 6mil, pad to pad 6mil, via to via 6mil, smd to smd 0mil, copper to edge 10mil, drill to drill 10mil, minimum pad ring 10mil, minimum via ring 6mil, stop-mask expansion 2mil, vias tented up to drill 100mil, thermal gap 10mil
tRestrict: area -1,42.2 to 7.5,78.2; area 46.1,33.8 to 52.1,40.8
bRestrict: area -1,42.2 to 7.5,78.2; area 46.1,33.8 to 52.1,40.9; area 21.4,56.3 to 28.4,63.2

### Footprints (pad centres in the part's own frame; a part is rotated, then mirrored left to right if it is on the bottom)
C1210 = smd 1.6 x 2.7: 1 -1.4,0; 2 1.4,0
SKRMAAE010 = smd 0.85 x 0.7: P$1 -1.875,1.65; P$2 -1.875,-1.65; P$3 1.875,1.65; P$4 1.875,-1.65
0603 = smd 1.1 x 1: 1 -0.85,0; 2 0.85,0
C0603 = smd 1.1 x 1: 1 -0.85,0; 2 0.85,0
C0805 = smd 1.3 x 1.5: 1 -0.95,0; 2 0.95,0
C0402 = smd 0.7 x 0.9: 1 -0.65,0; 2 0.65,0
SOT23 = smd 1 x 1.4: 1 -0.95,-1.1; 2 0.95,-1.1; 3 0,1.1
TRACE_ANTENNA_2.4GHZ_25.7MM = smd 0.46 x 0.46: ANT 0,0.23 | smd 1 x 0.46: GND -1.18,0.23; GND2 -3.38,0.23
QFN50P250X250X100-12N = smd 0.85 x 0.3: 1 -1.2,0.75; 2 -1.2,0.25; 3 -1.2,-0.25; 4 -1.2,-0.75; 7 1.2,-0.75; 8 1.2,-0.25; 9 1.2,0.25; 10 1.2,0.75 | smd 0.3 x 0.85: 5 -0.25,-1.2; 6 0.25,-1.2; 11 0.25,1.2; 12 -0.25,1.2
INDC2520X110N = smd 1.25 x 2.2: 1 -1.1,0; 2 1.1,0
WS2812B = smd 1.5 x 0.9: 1-VDD 2.45,-1.65; 2-DOUT 2.45,1.65; 3-GND -2.45,1.65; 4-DIN -2.45,-1.65
MS5637 = smd 1 x 1: GND 1,1; SCL 1,-1; SDA -1,-1; VDD -1,1
SOT65P210X110-3N = smd 1.168 x 0.457: 1 -0.94,0.66; 2 -0.94,-0.66; 3 0.94,0
R0603 = smd 1 x 1.1: 1 -0.85,0; 2 0.85,0
QFN50P300X300X120-16N = smd 0.965 x 0.305: 1 -1.321,0.991; 2 -1.321,0.508; 3 -1.321,0; 4 -1.321,-0.508; 5 -1.321,-0.991; 9 1.321,-0.991; 10 1.321,-0.508; 11 1.321,0; 12 1.321,0.508; 13 1.321,0.991 | smd 0.305 x 0.965: 6 -0.508,-1.321; 7 0,-1.321; 8 0.508,-1.321; 14 0.508,1.321; 15 0,1.321; 16 -0.508,1.321
SOT23-5 = smd 0.55 x 1.2: 1 -0.95,-1.3; 2 0,-1.3; 3 0.95,-1.3; 4 0.95,1.3; 5 -0.95,1.3
AQFN73 = smd 0.25 x 0.25: A8 -1.25,3.25; A10 -0.75,3.25; A12 -0.25,3.25; A14 0.25,3.25; A16 0.75,3.25; A18 1.25,3.25; A20 1.75,3.25; A22 2.25,3.25; A23 2.75,3.25; AA24 3.25,-2.25; AB2 -2.75,-2.5; AC5 -2,-2.75; AC9 -1,-2.75; AC11 -0.5,-2.75; AC13 0,-2.75; AC15 0.5,-2.75; AC17 1,-2.75; AC19 1.5,-2.75; AC21 2,-2.75; AC24 3.25,-2.75; AD2 -2.75,-3.25; AD4 -2.25,-3.25; AD6 -1.75,-3.25; AD8 -1.25,-3.25; AD10 -0.75,-3.25; AD12 -0.25,-3.25; AD14 0.25,-3.25; AD16 0.75,-3.25; AD18 1.25,-3.25; AD20 1.75,-3.25; AD22 2.25,-3.25; AD23 2.75,-3.25; B1 -3.25,2.75; B3 -2.5,2.75; B5 -2,2.75; B7 -1.5,2.75; B9 -1,2.75; B11 -0.5,2.75; B13 0,2.75; B15 0.5,2.75; B17 1,2.75; B19 1.5,2.75; B24 3.25,2.75; C1 -3.25,2.25; D2 -2.75,2; D23 2.75,2; E24 3.25,1.75; F2 -2.75,1.5; F23 2.75,1.5; G1 -3.25,1.25; H2 -2.75,1; H23 2.75,1; J1 -3.25,0.75; J24 3.25,0.75; K2 -2.75,0.5; L1 -3.25,0.25; L24 3.25,0.25; M2 -2.75,0; N1 -3.25,-0.25; N24 3.25,-0.25; P2 -2.75,-0.5; P23 2.75,-0.5; R1 -3.25,-0.75; R24 3.25,-0.75; T2 -2.75,-1; T23 2.75,-1; U1 -3.25,-1.25; U24 3.25,-1.25; V23 2.75,-1.5; W1 -3.25,-1.75; W24 3.25,-1.75; Y2 -2.75,-2; Y23 2.75,-2 | smd 4.75 x 4.75: PAD 0,0
TSOT26 = smd 0.7 x 1: P$1 0,0; P$2 0.95,0; P$3 1.9,0; P$4 1.9,2.2; P$5 0.95,2.2; P$6 0,2.2
SOIC8 = smd 2.2 x 0.5: CE 1.526,4.445; HOLD 8.234,3.165; SCK 8.234,1.895; SI 8.234,0.635; SO 1.526,3.175; VDD 8.234,4.435; VSS 1.526,0.635; WP 1.526,1.905
ZX80B5P = smd 0.4 x 1.3: 1 -1.3,0; 2 -0.65,0; 3 0,0; 4 0.65,0; 5 1.3,0 | drill 0.8: GND1 3.6,-1.3; GND4 -3.6,-1.3 | drill 0.9: GND2 -1.2,-2.65; GND3 1.2,-2.65
SR4G008 = smd 1 x 1: P$1 0,0; P$2 2,0; P$3 5.6,0; P$4 5.6,4.4; P$5 2,4.4; P$6 0,4.4
M10578 = smd 1 x 1: P$1 0,0; P$2 1.85,0; P$3 3.7,0; P$4 5.55,0; P$5 7.4,0; P$6 7.4,-1.85; P$7 7.4,-3.7; P$8 7.4,-5.55; P$9 7.4,-7.4; P$10 5.55,-7.4; P$11 3.7,-7.4; P$12 1.85,-7.4; P$13 0,-7.4; P$14 0,-5.55; P$15 0,-3.7; P$16 0,-1.85
STC3100 = smd 1.213 x 0.406: CG 4.1,0.65; GND 4.1,0; IO -0.1,1.95; ROSC -0.1,1.3; SCL -0.1,0; SDA -0.1,0.65; VCC 4.1,1.3; VIN 4.1,1.95
PROG_SMD = smd 1.27 x 1.27: GND 2.54,0; PIN1 0,1.27; PIN2 -2.54,0; VCC -5.08,1.27 | hole 1.5: 0,-2.54
NET_CONN = smd 1 x 1: 1 0,0; 2 1.5,0
VEML6075 = smd 0.9 x 0.35: P$1 0.05,0; P$2 0.05,-0.7; P$4 1.95,0 | smd 1 x 0.35: P$3 1.9,-0.7
SHARP27 = smd 1.8 x 0.25: 1 -3.12,-2.21; 2 -3.12,-1.71; 3 -3.12,-1.21; 4 -3.12,-0.71; 5 -3.12,-0.21; 6 -3.12,0.29; 7 -3.12,0.79; 8 -3.12,1.29; 9 -3.12,1.79; 10 -3.12,2.29 | smd 1.5 x 1.5: P$8 0.425,3.79; P$9 0.425,-3.71
KPA-2106SECK = smd 1.5 x 0.8: P$1 0,0; P$2 2.6,0
CRYSTAL-SMD-5X3.2-4PAD = smd 1.9 x 1.1: 1 -1.85,-1.15; 2 1.85,-1.15; 3 1.85,1.15; 4 -1.85,1.15
CRYSTAL-SMD-3.2X1.5MM = smd 1 x 1.8: P$1 -1.25,0; P$2 1.25,0

### Placement (x,y rotation side)
BATT  36.07,22.99 90 bottom
BTNC1  26.16,4.19 0 top
BTND1  42.55,5.21 0 top
BTNG1  9.78,5.21 0 top
C1  34.8,8.38 270 bottom
C2  30.99,64.14 90 bottom
C3  36.45,8.38 270 bottom
C4  45.34,12.57 90 bottom
C5  37.34,16.13 180 bottom
C6  38.32,73.53 90 bottom
C7  42.25,67.19 90 bottom
C8  35.71,70.22 90 bottom
C9  35.88,72.73 0 bottom
C10  48.54,57.75 180 top
C11  29.21,23.5 180 bottom
C12  25.02,22.86 0 bottom
C13  24,28.32 90 bottom
C14  39.24,23.62 180 bottom
C15  43.56,25.4 90 bottom
C16  46.61,21.97 0 bottom
C17  31.68,57.61 180 bottom
C18  22.05,47.62 270 bottom
C19  41.25,57.23 0 bottom
C20  31.67,56.11 180 bottom
C21  41.27,55.12 0 bottom
C22  29.46,64.14 270 bottom
C23  27.81,65.79 270 bottom
C24  18.87,63.32 180 bottom
C25  23.62,65.41 270 bottom
C26  21.56,66.6 90 bottom
C27  16.33,70.33 0 bottom
C28  18.97,64.82 180 bottom
C29  18.82,58.9 180 bottom
C30  20.95,55.25 0 bottom
C31  24.45,52.7 270 bottom
C32  35.97,61.9 0 bottom
C33  35.97,63.55 0 bottom
C34  9.14,64.77 90 bottom
C35  14.1,62.36 135 bottom
C36  26.92,42.8 90 bottom
C37  21.31,19.18 180 bottom
C38  38.86,38.99 90 bottom
C39  44.32,38.99 90 bottom
C40  40.13,45.72 180 bottom
C41  40.13,43.43 180 bottom
C42  31.67,54.61 180 bottom
C43  21.13,42.7 90 bottom
C44  21.77,24.69 180 bottom
D1  40.77,14.35 180 bottom
D3  32.26,25.15 270 bottom
E1  7.62,64.14 270 bottom
FB1  11.56,63.25 45 bottom
IC1  27.05,26.8 90 bottom
L1  29.08,20.96 0 bottom
L2  41.53,38.1 0 bottom
L4  48.64,72.01 90 top
MS1  48.53,60.32 0 top
Q2  48.01,66.17 90 top
R1  44.53,47.85 0 bottom
R2  44.53,49.29 0 bottom
R3  32.89,8.38 90 bottom
R8  33.78,11.18 0 bottom
R9  37.34,14.1 0 bottom
R10  44.32,15.37 0 bottom
R11  43.56,12.57 270 bottom
R12  27.43,30.35 0 bottom
R13  17.34,45.08 90 bottom
R14  30.1,28.32 90 bottom
R15  40.13,21.59 0 bottom
R16  18.77,40.79 0 bottom
R17  19.66,43.61 270 bottom
R18  50.16,66.29 270 top
R19  47.88,63.5 180 top
R20  27.94,11.05 90 bottom
R21  37.59,31.62 0 bottom
R22  22.22,74.55 0 top
R23  24.13,10.92 180 bottom
R24  22.99,13.46 270 bottom
R25  46.74,19.56 180 bottom
R26  49.4,18.92 90 bottom
R27  49.66,25.53 90 bottom
R30  44.3,64.77 270 bottom
R31  23.09,70.66 180 bottom
T1  25.91,13.46 90 bottom
T2  42.67,18.16 270 bottom
U1  38.85,69.49 270 bottom
U2  46.61,25.15 0 bottom
U4  24.89,59.69 0 bottom
U$1  47.83,10.39 180 bottom
U$2  11.13,52.93 180 bottom
U$3  47.78,48.35 270 bottom
U$4  46.86,40.13 270 top
U$5  29.34,40.01 180 bottom
U$6  40,29.59 270 bottom
U$7  2.95,26.49 270 bottom
U$8  15.67,63.99 315 bottom
U$14  47.62,56.39 0 top
U$15  3.05,73.53 270 top
U$16  11.62,42.12 0 bottom
U$17  16.51,9.4 0 top
U$18  33.15,9.4 0 top
U$19  27.43,74.68 180 top
Y2  17.48,67.54 0 bottom
Y3  33.53,62.87 270 bottom

### Tracks (layer width: path | path; a pad name or v marks a point on that pad's centre or on a via)
ANT  (via drill 0.3)
  Top 0.635: 44.36,38.13 v44.32,38.1
  Top 0.762: U$4.P$2 44.36,38.13
  Bottom 0.152: C39.1 v44.32,38.1
  Bottom 0.635: 42.42,38.14 L2.1
  Bottom 0.762: 42.42,38.14 C39.1
BCK_LED_TR  (via drill 0.3)
  Top 0.152: U$19.P$1 24.15,71.4 21.74,71.41 17.83,67.49 17.83,37.62 17.91,37.54 v17.91,37.47 | v23.88,20.83 27.05,17.65 v27.05,14.73
  Bottom 0.152: R20.2 27.01,12.83 T1.3 27.05,13.51 v27.05,14.73 | v17.91,37.47 19.84,35.54 19.84,22.99 22,20.83 v23.88,20.83
BTNC  (via drill 0.3)
  Top 0.152: v28.07,4.06 28.07,3.59 BTNC1.P$4 BTNC1.P$2
  Bottom 0.152: D1.3 40.82,13.2 40.82,11.86 37.38,8.43 35.18,8.43 34.8,8.05 C1.2 R3.1 31.03,7.53 28.07,4.57 v28.07,4.06
BTND  (via drill 0.35)
  Top 0.152: BTND1.P$4 BTND1.P$2 40.67,5.3 38.23,7.75 38.23,12.07 33.53,16.76 33.53,34.67 32.28,35.92 32.28,44.93 v26.92,50.29
  Bottom 0.152: v26.92,50.29 26.14,51.07 U4.AD8
BTNG  (via drill 0.3)
  Top 0.152: BTNG1.P$2 BTNG1.P$4 11.65,5.18 v11.81,5.33 | v19.43,11.3 19.94,11.3 21.77,13.13 21.77,33.67 v21.61,33.83
  Bottom 0.152: U4.AD12 25.14,54.56 25.23,54.48 25.23,50.76 24.13,49.66 24.13,37.59 21.61,35.07 v21.61,33.83 | v19.43,11.3 14.73,11.3 12.95,9.52 12.95,6.35 11.94,5.33 v11.81,5.33
BYP
  Bottom 0.203: U1.2 38.34,72.66 C6.1
CRST
  Bottom 0.178: C7.2 42.25,68.75 42.06,68.94 40.44,68.94 U1.8
DEC1
  Bottom 0.152: U4.C1 30.7,61.94 30.99,62.23 C2.1
DEC2
  Bottom 0.178: U4.A18 23.64,64.73 C25.2
DEC3
  Bottom 0.178: U4.D23 22.14,61.8 21.97,61.98 20.86,61.98 C24.2
DEC4_6  (via drill 0.3)
  Top 0.178: v19.91,62.08 20.9,62.08 22.33,63.5 25.65,63.5 26.16,64.01 v26.88,64.01 v26.89,64.02
  Bottom 0.152: v19.91,62.08 20.4,61.59 21.49,61.59 U4.E24
  Bottom 0.178: U4.B5 v26.89,64.02 C23.2 | v19.91,62.08 20.07,61.92
DEC5
  Bottom 0.152: U4.N24 21.57,59.36 20.13,59.36 C29.2
DECUSB
  Bottom 0.152: U4.AC5 27.01,56.82 28.34,56.82
  Bottom 0.305: C42.1 30.54,54.61 29.5,55.65 29.41,55.74 29.09,56.06 | 28.34,56.82 29.09,56.06 | C20.1 29.13,56.11 29.09,56.06
DISP1
  Bottom 0.152: R17.2 18.95,42.76 18.1,41.91 U$16.5 | 19.64,42.79 R17.2 | R17.2 20.45,43.55 C43.2
EXTCOMM1
  Bottom 0.152: U$16.4 16.34,41.41 16.95,40.79 R16.2
EXTMODE1
  Bottom 0.152: U$16.8 16.36,43.41 17.04,44.09 17.04,44.23 R13.1
FIX  (via drill 0.3)
  Top 0.152: v29.97,49.4 29.97,59.31 29.87,59.41 v29.69,59.41
  Bottom 0.152: U$5.P$13 29.34,48.77 v29.97,49.4 | v29.69,59.41 28.17,59.41 U4.N1
FXOS_RST
  Bottom 0.152: U4.A12 25.14,64.18 25.45,64.49 25.45,69.39 26.29,70.23 35.04,70.23 35.05,70.22 36.59,70.22 36.83,69.98 37.51,69.98 U1.16
GND  (via drill 0.3, 0.51)
  Top 0.152: U$14.P$1 47.69,56.4
  Top 0.305: 47.69,56.4 C10.2
  Top 0.635: 46.86,33.02 U$4.P$3 45.35,34.53 45.34,34.54 | U$4.P$4 51.26,33.06 51.31,33.02 | U$4.P$6 51.18,40.21 51.18,41.78
  Bottom 0.152: C40.2 C41.2 | 26.39,61.37 v26.16,61.14 | 23.62,61.19 v23.62,61.14 | v15.68,64.01 U$8.1
  Bottom 0.203: IC1.2 | v42.29,65.2 42.29,66.3 C7.1 | C9.2 34.94,72.82 v33.91,72.82 | v34.54,71.04 35.69,71.04 C8.2 | v38.1,75.36 38.11,74.6 C6.2 38.54,74.6 v39.5,74.6 | U1.7 42.96,69.49 v43.05,69.39 | U1.5 39.95,70.92 v41.15,70.92 | U1.12 U1.13 36.62,68.17 v36.45,68 | U1.10 39.36,66.84 v39.12,66.6 | v39.5,72.57 39.18,72.25 39.18,71.99 38.85,71.66 U1.3 | v24.38,51.23 24.45,51.3 C31.2
  Bottom 0.229: IC1.6 26.28,27.05 26.79,26.99 27.24,26.99 27.3,26.92 | U$7.GND 2.95,22.96 v2.9,22.91 | v26.95,23.27 27,23.27 27.3,23.57 | C12.1 26.54,22.86 v26.95,23.27 | C11.1 28.03,23.27 v26.95,23.27 | U4.B7 26.54,62.59 26.54,63.45 26.19,63.8 26.11,63.8 26.11,64.2 26.12,64.21 26.12,64.76 26.21,64.85
  Bottom 0.254: U4.B7 26.39,61.37
  Bottom 0.305: IC1.9 IC1.2 27.3,26.92 | IC1.2 27.3,23.57 27.3,22.86 | v36.7,30.53 36.74,30.62 R21.2 | C5.1 36.49,17.28 v36.45,17.32 | v49.4,16.94 R26.1 | R24.1 22.99,15.09 v23.29,15.39 | v24.51,15.55 24.51,15.47 24.81,15.17 T1.2 | 20.54,19.3 20.52,19.24 C37.1 20.21,18.92 v19.25,18.92 | v19.63,41.55 19.63,40.81 R16.1 | C30.2 20,55.68 v19.05,55.68 v19.05,54.91 | v21.95,68.61 21.95,68.4 21.56,68.02 C26.2 21.11,67.91 v21.11,68.63 | v24.13,67.11 24.13,66.56 C25.1 | v37.49,63.7 37.34,63.55 C33.1 | v37.52,61.95 37.47,61.9 C32.1 | C3.2 36.45,6.66 v36.07,6.27 v36.96,6.27 | T2.2 44.27,17.7 v44.96,17.7 | U4.PAD v24.89,59.61
  Bottom 0.406: C34.2 8.2,66.13 8.2,66.7 E1.GND2
  Bottom 0.889: E1.GND 8.51,65.31 C34.2 | 7.24,67.56 9.14,67.56
  other vias: 11.94,59.49 13.16,60.96 27.3,67.74 28.19,67.74 29.84,66.09 29.08,66.09 38.86,55.55 34.14,56.69 34.14,55.91 26.16,58.22 23.62,58.22 30.73,66.09 41.27,23.04 41.27,24.05 41.27,25.2 28.07,41.83 27.99,40.06 29.31,38.68 31.14,38.71 38.61,41.83 38.61,40.94 37.85,39.93 41.53,39.8 41.53,40.82 41.53,41.83 44.32,41.07 46.23,41.45 47.5,41.45 48.77,41.45 50.04,41.45 51.31,41.45 45.34,36.88 45.34,35.86 45.34,34.72 46.99,33.2 48.51,33.2 49.91,33.2 51.31,33.2 33.15,41.45 33.78,37.13 35.81,37.13 36.83,37.13 37.85,37.13 47.62,46.02 46.61,46.02 45.59,46.02 46.23,46.84 50.29,53.14 51.05,52.25 14.35,45.52 14.88,46.56 16.03,46.18 22.86,27.61 22.86,28.5 31.24,29.39 30.48,30.02 46.48,56.57 8.13,76 8.13,74.73 8.13,73.46 8.13,72.06 8.13,70.92 8.13,69.52 8.13,62.66 8.13,61.52 8.13,60.25 8.13,58.72 8.13,57.45 8.13,56.06 8.13,54.53 8.13,53.14 8.13,51.74 8.13,50.34 8.13,48.95 8.13,47.42 27.18,49.07 27.18,47.8 27.18,46.53 8.13,45.77 6.48,41.58 9.14,76.63 5.08,41.58 3.68,41.58 8.13,66.85 8.13,68.25 11.94,61.52 14.22,60.05 11.05,62.28 10.19,62.92 9.91,65.2 13.33,63.17 15.37,61.9 16.38,61.9 12.45,63.93 11.43,64.95 27.94,54.41 28.07,53.26 28.7,49.96 30.99,52.25 30.99,49.96 32.89,52.12 35.69,52.12 37.72,50.09 38.99,49.71 40.89,51.1 39.75,51.87 38.23,52.12 41.66,47.42 42.67,49.45 28.96,52.37 49.66,23.55 49.66,22.4 49.66,21.39 38.86,54.66 8.13,65.33 8.13,44.37 8.13,42.98 8.13,41.58 45.47,39.29 45.47,40.44 32.38,49.96 16.51,58.9 16.64,58.04 11.84,53.11 13.21,53.09 48.74,7.19 14,55.8 19.86,53.44 6.3,12.57 14.63,15.19 15.8,24.79 5.49,19.23 16.97,29.18 11.15,21.29 4.98,33.68 9.45,34.29 5.59,30.63 30.51,32.46 26.64,33.5 29.24,35.48 36.75,34.59 41.88,30.91 49.28,30.61 29.72,17.93 39.93,17.25 34.7,3.53 17.32,3.96 21.69,9.5 30.43,10.54 13.03,69.01 28.57,72.64 32.33,75.59 43.61,75.54 41.96,72.62 40.46,64.01 40.56,62.41 36.4,59.21 40.23,58.65 42.44,59.39 42.55,35 22.07,45.69 17.98,34.98 19.76,37.74 14.27,37.44 15.57,65.28 47.14,12.42 49.68,12.29 43.99,10.13 25.02,30.58 30.48,30.94 27.08,26.82 28.17,23.37 25.7,22.83 28.27,18.8 31.75,17.22 26.14,39.67 35.36,44.65 32.66,46.02 30.94,42.67 44.5,43.41 46.53,43.51 44.5,56.9 34.24,54.41 20.83,25.7 20.78,23.72 11.53,71.32 19.23,71.93 33.5,74.63 31.88,72.39 48.74,76.23 48.56,71.88 48.77,68.73 25.5,47.65
  pour Bottom (rank 3, no thermals): 22.73,30.1 31.24,30.1 31.75,29.59 31.75,22.35 31.5,22.1 25.15,22.23 25.15,23.62 26.54,23.62 26.67,23.75 26.67,26.92 22.48,26.92 22.48,29.84
  pour Bottom (no thermals): 50.29,20.83 40.51,20.83 40.26,21.08 40.26,22.86 39.88,23.24 39.88,25.91 40.13,26.16 41.53,26.16 42.42,25.27 50.29,25.27
  pour Top (rank 6, no thermals): -9.52,93.09 67.94,93.09 67.94,-20.57 -9.52,-20.57
  pour Bottom: 26.92,65.79 26.92,67.94 27.05,68.07 28.57,68.07 29.59,67.06 31.75,67.06 32.38,66.42 32.38,65.02 31.88,64.52 29.72,64.52 28.45,65.79
  pour Bottom (rank 6, no thermals): -6.86,91.01 70.61,91.01 70.61,-22.66 -6.86,-22.66
GPS_RST  (via drill 0.3)
  Top 0.152: v33.15,59.89 37.44,55.6 37.44,54.8 37.19,54.54 37.19,49.87 37.67,49.39 37.67,44.37 v38.33,43.7
  Bottom 0.152: U$5.P$7 v38.33,43.7 39.01,43.7 C41.1 | U4.J1 32.6,60.44 v33.15,59.89
GPS_RX  (via drill 0.3)
  Top 0.152: v36.83,48.9 36.83,55.2
  Top 0.203: 36.83,55.2 v36.74,55.3
  Bottom 0.152: U4.R1 28.26,58.82 33.98,58.82 36.58,56.26 36.74,56.1 v36.74,55.3 | U$5.P$9 36.74,48.68 36.83,48.77
  Bottom 0.203: 36.83,48.77 v36.83,48.9
GPS_STDBY  (via drill 0.3)
  Top 0.152: v32.31,59.59 36.04,55.86 36.04,54.68 36.47,54.25 36.47,49.56 36.17,49.26 36.17,45.97 36.59,45.55 U$5.P$8
  Bottom 0.152: U$5.P$8 39.12,45.55 C40.1 | U4.L1 28.67,59.94 28.72,60 31.9,60 v32.31,59.59
  other vias: 36.74,45.55
GPS_TX  (via drill 0.3)
  Top 0.152: v34.92,48.64 v34.92,55.37
  Bottom 0.152: U4.U1 33.76,58.44 34.92,57.28 v34.92,55.37 | U$5.P$10 34.92,47.44 v34.92,48.64
INT1
  Bottom 0.152: U4.A10 25.64,64.22 25.78,64.35 25.78,69.26 26.43,69.9 31.93,69.9 34.75,67.08 38.71,67.08 38.85,67.22 U1.11
INT_PSWITCH
  Bottom 0.152: R11.1 43.56,15.28 R10.2 43.39,15.45 D1.2 41.57,15.6 T2.3
KILL_NRF  (via drill 0.3)
  Top 0.152: v24.13,68.96 24.26,69.09 29.23,69.09 30.02,68.3 v31.37,68.3 | v41.02,28.45 38.48,30.99 38.48,40.32 38.08,40.72 38.08,42.05 38.89,42.87 38.89,43.94 38.46,44.37 38.46,51.14 37.54,52.05 37.54,54.41 38.25,55.12 38.25,64.19 v36.54,65.9
  Bottom 0.152: R25.2 49.19,19.56 | 49.19,19.56 R26.2 | 49.19,19.56 50.67,19.56 51.05,19.94 51.05,27.69 50.29,28.45 v41.02,28.45 | U4.A20 23.14,63.6 22.61,64.14 22.61,66.55 23.88,67.82 23.88,68.83 24,68.96 v24.13,68.96 | v31.37,68.3 33.77,65.9 v36.54,65.9
L1  (via drill 0.3)
  other vias: 28.83,25.78 28.83,24.89 31.5,21.59 31.5,20.7
  pour Top (no thermals): 28.32,25.91 28.32,24.26 30.61,21.97 30.61,20.32 30.99,19.94 32,19.94 32.26,20.19 32.26,21.84 29.59,24.51 29.59,26.04 29.46,26.16 28.57,26.16
  pour Bottom (no thermals): 29.72,21.97 31.88,21.97 32,21.84 32,20.07 31.88,19.94 29.72,19.94
  pour Bottom (no thermals): 27.74,26.16 27.74,24.46 27.81,24.38 29.46,24.38 29.59,24.51 29.59,26.04 29.46,26.16
L2  (via drill 0.3)
  Bottom 0.305: 26.8,25.91 26.8,24.77 v26.42,24.38
  other vias: 25.53,24.38 26.67,21.34 26.67,20.45
  pour Top (no thermals): 25.02,24.13 25.02,24.64 25.15,24.77 27.3,24.77 27.43,24.64 27.43,20.07 27.3,19.94 26.16,19.94 26.04,20.07 26.04,23.5
  pour Bottom (no thermals): 26.04,21.72 26.29,21.97 28.32,21.97 28.45,21.84 28.45,19.94 26.16,19.94 26.04,20.07
  pour Bottom (no thermals): 25.02,23.88 25.02,24.64 25.15,24.77 26.54,24.77 26.67,24.89 26.67,25.91 26.92,25.91 26.92,24 26.8,23.88
LED_BCK
  Bottom 0.152: R23.2 24.98,12.34 arc90 T1.1
LS027_CS
  Bottom 0.152: U4.AD20 23.14,55.04 23.04,54.93 23.04,42.09 20.95,40.01 17.04,40.01 16.14,40.91 U$16.3
LS027_MO
  Bottom 0.152: U$16.2 16.11,40.41 16.92,39.6 21.13,39.6 23.37,41.83 23.37,54.8 23.64,55.07 U4.AD18
LS027_SCK
  Bottom 0.152: U4.AD16 24.14,55.1 23.7,54.66 23.7,41.65 21.32,39.27 16.73,39.27 16.09,39.91 U$16.1
MBAT
  Bottom 0.152: U$6.CG 39.35,24.4 39.21,24.26 39.21,21.66 R15.2
  Bottom 0.635: BATT.1 R15.2
N$3
  Bottom 0.152: 21.11,60.7 21.29,60.8 21.95,60.8 U4.H23
  Bottom 0.381: 21.11,60.7 19.86,60.7
  Bottom 0.406: 19.86,60.7 19.72,60.77 19.09,60.77 18.92,60.94
  Bottom 0.635: FB1.1 12.91,61.9 C35.1 14.59,60.94 18.92,60.94
N$7
  Bottom 0.635: E1.ANT 9.11,64.14 C34.1 10.63,63.92 FB1.2
N$9  (via drill 0.3)
  Top 0.152: v39.17,11.43 40.34,11.43 42.49,9.27 v46.53,9.27
  Bottom 0.152: R8.1 34.63,9.4 C1.1 C3.1 36.97,9.23 v39.17,11.43 | U$1.P$3 49.73,9.7 49.28,9.25 48.18,9.25 47.83,8.89 | 47.83,8.89 U$1.P$6 | v46.53,9.27 47.45,9.27 47.83,8.89
N$10
  Bottom 0.152: U4.F23 21.89,61.19 21.79,61.09 21.5,61.09 21.39,61.19 19.89,61.19 19.53,61.54 17.96,61.54 16.94,62.56 14.81,62.56 C35.2 14.61,62.87 U$8.2
N$12
  Bottom 0.152: T2.1 45.44,19.11 R25.1
N$13
  Bottom 0.381: R27.2 47.63,26.38 U2.5
N$15
  Bottom 0.152: R11.2 C4.1 45.34,10.8 45.72,10.41 47.8,10.41 U$1.P$1
N$16
  Top 0.305: R22.2 23.2,74.68 U$19.P$2
N$17  (via drill 0.35)
  Top 0.305: U$17.P$1 16.51,8.38 17.91,6.98 21.46,6.98 23.49,9.02 27.81,9.02 27.94,9.14 v27.94,9.27 33.02,9.27 U$18.P$1
  Bottom 0.305: v27.94,9.27 R20.1
NEO_DIN
  Top 0.152: Q2.3 50.13,67.11 R18.1 50.29,67.27 L4.4-DIN
NEO_PIN  (via drill 0.3)
  Top 0.152: Q2.2 48.67,63.56 R19.1 48.64,63.63 48.39,63.37 v48.39,62.48
  Bottom 0.152: v48.39,62.48 45.59,62.48 43.97,60.86 32.52,60.86 32.44,60.94 U4.G1
NRF_BTNC  (via drill 0.3)
  Top 0.152: v32.79,20.19 32.89,20.19 32.89,33.78 v32.51,34.16
  Bottom 0.152: C5.2 R9.1 | D1.1 39.14,16.13 C5.2 | U4.AD10 25.64,50.56 24.51,49.43 24.51,37.34 27.69,34.16 v32.51,34.16 | v32.79,20.19 33.3,19.69 37.85,19.69 38.19,19.34 C5.2
PG
  Bottom 0.152: 26.8,30.19 R12.2
  Bottom 0.305: IC1.8 26.8,30.19
PIN_BCK
  Bottom 0.152: R24.2 22.99,11.21 arc90 R23.1
PW_EN  (via drill 0.3)
  Top 0.152: L4.1-VDD 51.2,73.55 51.2,66.48 R18.2
  Top 0.254: R18.2 51.44,64.17 51.44,56.36 49.83,54.76 47.07,54.76 40.89,48.55 40.89,34.53 v46.33,29.09 46.61,28.81 v46.61,15.37
  Bottom 0.152: IC1.11 29.67,27.05 R14.1 33.39,27.47 34.37,28.45 40.11,28.45 40.69,29.03 46.28,29.03 v46.33,29.09 | R10.1 45.17,13.59 C4.2 | 47.95,14.79 49.39,14.79 50.42,13.77 50.42,8.74 49.87,8.19 U$1.P$4
  Bottom 0.254: 47.95,14.79 47.37,15.37 v46.61,15.37 R10.1
RF_IN
  Bottom 0.635: 38.9,38.1 C38.1 | 33.02,39.99 arc-90 U$5.P$3
  Bottom 0.762: L2.2 38.9,38.1 | C38.1 33.74,38.14 arc-90 33.02,38.86 33.02,39.99
ROSC
  Bottom 0.152: U$6.ROSC 38.7,31.36 R21.1
SCL  (via drill 0.3)
  Top 0.152: 49.97,55.66 51.05,56.74 51.05,58.33 50.8,58.58 v50.8,59.69 50.43,59.32 MS1.SCL | 49.97,55.75 49.59,55.75 U$14.P$3 49.94,55.69 49.97,55.66 | v40.39,33.78 40.26,48.54 46.91,55.19 49.58,55.19 49.97,55.58 49.97,55.66
  Bottom 0.152: U4.A16 24.14,64.12 24.79,64.76 24.79,69.77 24.8,69.79 | 24.8,69.79 25.98,70.97 28.7,70.97 34.01,76.28 38.99,76.28 40.39,74.88 40.39,73.41 | v50.8,59.69 50.8,72.64 50.42,73.03 45.59,73.03 45.21,73.41 40.39,73.41 | U$6.SCL 40,32 40.39,32.39 v40.39,33.78 | U1.4 39.36,71.49 39.75,71.88 40.13,71.88 40.39,72.14 40.39,73.41 | R31.2 24.8,69.8 24.8,69.79
SDA  (via drill 0.3, 0.35)
  Top 0.152: v33.15,71.88 33.15,72.92 36.32,76.1 40.11,76.1 44.96,71.25 v44.96,70.36 | v44.96,62.74 44.96,60.45 46.09,59.32 | 46.09,59.32 46.36,59.05 | 46.09,59.32 MS1.SDA 46.62,59.32 45.82,58.52 45.82,55.65 46.36,55.12 | U$14.P$2 46.93,55.69 46.36,55.12 | 46.36,55.12 39.85,48.61 39.85,35.03 v39.5,34.67
  Bottom 0.152: U4.A14 24.64,64.15 25.12,64.63 25.12,69.6 26.11,70.59 31.85,70.59 v33.15,71.88 | U1.6 41.97,69.99 41.99,70.02 44.87,70.02 44.96,70.1 v44.96,70.36 44.96,68.96 45.72,68.2 45.72,63.5 v44.96,62.74 44.96,63.26 R30.2 | v39.5,34.67 39.35,34.53 U$6.SDA
SPI_MI
  Bottom 0.152: U$2.SO 11.12,49.76 10.72,50.16 10.72,55.09 15.82,60.19 21.34,60.19 21.58,60.44 U4.J24
SPI_MO
  Bottom 0.152: U4.W24 21.62,57.92 21.59,57.92 20.89,57.23 18.44,57.23 16.53,55.32 16.53,53.62 17.88,52.27 17.91,52.3 U$2.SI
SPI_SCK
  Bottom 0.152: U4.U24 21.62,58.42 21.54,58.42 20.68,57.56 18.3,57.56 16.15,55.41 16.15,52.91 18.03,51.03 18.04,51.04 U$2.SCK
SS
  Bottom 0.152: C13.2 24.09,29.08 25.65,29.08 26.3,28.44 IC1.7
SST_CS
  Bottom 0.152: U4.R24 21.56,58.95 20.5,57.89 18.17,57.89 15.77,55.49 15.77,50.06 14.2,48.49 U$2.CE
SST_HOLD
  Bottom 0.152: U4.AD22 22.64,49.95 22.4,49.71 19.42,49.71 U$2.HOLD
SST_WP
  Bottom 0.152: U4.L24 21.58,59.94 21.5,59.86 16.01,59.86 11.05,54.91 11.05,51.31 11.38,50.98 11.43,51.03 U$2.WP
SWDCLK  (via drill 0.3)
  Top 0.152: v17.09,54.94 17.09,36.52 v16.92,36.35
  Bottom 0.152: U4.AA24 21.62,57.46 21.05,56.9 18.64,56.9 17.09,55.35 v17.09,54.94 | v16.92,36.35 9.22,28.65 5.26,28.65 3.02,26.42 1.75,26.42 U$7.PIN1
SWDIO  (via drill 0.3)
  Top 0.152: v18.59,53.77 18.59,52.5 18.57,52.48 18.57,38.71 18.8,38.48 18.8,36.86 17.6,35.66 15.42,35.66 v15.34,35.59
  Bottom 0.152: U4.AC24 21.27,56.57 18.82,56.57 17.73,55.47 17.73,54.53 18.49,53.77 v18.59,53.77 | v15.34,35.59 8.79,29.03 U$7.PIN2
USB_D0_N
  Bottom 0.305: U4.AD4 27.14,53.22 arc90 29.08,51.28 33.53,51.28 arc-90 34.33,50.48 arc90 34.68,50.14 34.92,50.14 arc90 35.27,50.48 arc-90 36.07,51.28 38.86,51.28 arc-90 40.36,49.78 arc90 41.4,48.74 43.73,48.74 arc90 R2.2
USB_D0_P
  Bottom 0.305: U4.AD6 26.64,53.27 arc90 29.08,50.83 33.53,50.83 arc-90 33.88,50.48 arc90 34.68,49.68 34.92,49.68 arc90 35.73,50.48 arc-90 36.07,50.83 38.86,50.83 arc-90 39.9,49.78 arc90 41.4,48.29 43.72,48.29 arc-90 R1.2
USB_D1_N
  Bottom 0.305: U$3.2 45.07,49 arc-90 R2.1
USB_D1_P
  Bottom 0.305: U$3.3 46.16,48.35 45.66,47.85 R1.1
VBAT  (via drill 0.3, 0.35)
  Top 0.229: v33.78,35.87 34.16,35.48 34.16,26.47 34.72,25.91 v35.38,25.91
  Top 0.305: v35.56,18.42 39.5,18.42 40.59,19.51 | 40.59,19.51 44.7,15.39 44.7,14.99 45.59,14.1 48.64,14.1 v48.89,13.84 | 40.59,19.51 42.67,21.59 v42.67,22.23
  Top 0.381: v42.67,22.23 38.73,22.23 v38.35,22.61
  Bottom 0.152: 32.89,11.14 R8.2
  Bottom 0.229: v48.89,13.84 48.78,13.73 U$1.P$2 | U$5.P$14 29.35,45.54 30.43,45.54 32.21,43.76 32.21,37.44 v33.78,35.87 | v35.38,25.91 35.88,25.41 35.88,24.2
  Bottom 0.305: R3.2 32.89,11.14 | v38.35,22.61 38.1,22.86 38.1,23.33 C14.1 | R8.2 32.93,16.55 34.8,18.42 v35.56,18.42
  Bottom 0.381: U2.3 45.66,22.53 | 45.66,22.53 C16.2 | 45.66,22.53 44.24,22.53 43.94,22.23 v42.67,22.23 | D3.2 35.88,24.2 BATT.2
  pour Bottom (no thermals): 32.64,23.62 32.77,23.5 37.47,23.5 37.85,23.11 38.86,23.11 38.86,26.04 36.58,26.04 35.81,25.27 32.64,25.27
VCC  (via drill 0.3, 0.35)  (1 unrouted)
  Top 0.152: C10.1 49.58,57.57 | 47.35,63.82 47.35,65.02 47.35,65.05
  Top 0.203: v46.61,64.8 46.86,64.8 47.09,65.02 47.35,65.02 | 27.3,65.66 23.09,65.66 21.56,65.66 v21.51,65.71
  Top 0.229: R19.2 47.35,63.82 47.35,65.05 | 47.35,65.05 Q2.1 47.07,65.51 v46.61,65.51 | v46.61,64.8 46.86,65.05 47.35,65.05 | v12.5,34.19 18.57,34.19 22.61,38.23 v22.61,39.12 | U$17.P$2 22.61,12.89 22.61,18.24 23.37,19 v23.37,19.18 | v23.06,67.92 23.06,65.68 23.09,65.66 | v21.97,75.82 28.98,75.82 30.84,73.97 30.84,70.69 30.81,70.66 32.26,69.22 v34.49,69.22 | 29.52,62.66 v29.46,62.61 29.46,63.5 27.3,65.66 | v28.07,43.7 23.1,43.7 v22.48,44.32
  Top 0.254: 28.07,57.79 v29.34,57.79
  Top 0.305: 49.58,57.57 U$14.P$4 | v46.23,61.09 46.46,61.32 MS1.VDD 48.51,60.33 48.51,58.85 49.39,57.98 C10.1 | U$18.P$2 36.33,9.98 36.33,11.59 v36.98,12.24 | 19.18,8.89 v18.67,8.38 | 19.18,8.89 19.18,9.33 U$17.P$2 | v19.68,8.38 19.18,8.89 | v21.46,54.36 v24.64,54.36 27.81,57.79 28.07,57.79 28.07,61.21 v29.46,62.61
  Top 0.635: v21.97,73.28 21.38,73.88 R22.1 21.38,75.22 v21.97,75.82
  Bottom 0.152: C9.1 36.73,71.94 U1.1 | U1.14 36.11,68.98 C8.1
  Bottom 0.178: U4.AD14 24.64,54.3 24.64,53.74 C31.1 | U4.A22 22.64,63.41 | U4.AD23 21.61,55.91 C30.1
  Bottom 0.203: 28.3,57.79 v29.34,57.79 | IC1.5 25.34,26.04 v24.13,26.04 | C36.2 26.98,43.7 v28.07,43.7
  Bottom 0.229: C8.1 34.65,69.37 v34.49,69.22 | C9.1 36.73,73.76 v36.78,73.81 | U$16.6 17.83,42.41 18.33,42.91 | 18.33,42.91 19.66,44.25 R17.1 19.81,44.46 20.34,45 v20.85,45 | U$16.7 18.33,42.91 | R12.1 28.56,30.63 v29.39,30.63 | R30.1 v44.3,66.6 | U$7.VCC 9.88,31.57 v12.5,34.19 | R31.1 22.24,69.84 23.06,69.01 v23.06,67.92 | U$2.VDD 20.91,48.5 v20.95,48.54 21.98,48.54 C18.1 | R9.2 v35.18,14.1 | v23.37,19.18 23.41,19.18 23.43,19.2 | C26.1 v21.51,65.71 | v24.64,54.36 24.64,54.31 24.64,54.3 | v22.86,22.48 23.24,22.86 C12.2 23.37,22.86 v22.86,23.37 | IC1.4 26.3,25.26 26.11,25.07 25.53,25.07 24.56,26.04 v24.13,26.04 | C30.1 21.6,54.5 v21.46,54.36 | C22.2 v29.46,62.61 29.29,62.44 U4.B1
  Bottom 0.254: 22.64,63.41 21.56,64.37 C26.1 | U4.Y2 27.89,57.69 U4.W1 28.3,57.79
  Bottom 0.305: U$5.P$15 v28.07,43.7 | 23.43,19.2 v23.37,19.18 C37.2 | R31.1 22.24,73.01 v21.97,73.28
  Bottom 0.381: v29.34,57.79 29.84,57.28 30.83,57.28
  other vias: 23.11,26.04 24.13,24.77 23.11,24.77 35.36,12.8 31.37,15.24 34.04,14.86 34.04,13.08 31.37,13.46 30.1,15.24 30.1,13.46 22.48,42.8
  pour Top: 29.84,16 34.42,16 37.47,12.95 37.47,11.94 37.34,11.81 29.72,11.81 29.34,12.19 29.34,15.49
  pour Top (rank 2, no thermals): 31.7,12.93 26.62,12.93 25.88,13.67 25.88,16.21 22.3,19.79 22.3,33.6 20.55,35.36 20.55,44.37 18.52,46.41 18.52,50.22 20.98,52.68 20.98,56.03 21.84,56.9 25.68,56.9 27.69,58.9 27.69,63.27 36.2,72.03 36.2,74.37 36.5,74.68 37.31,74.68 44.5,67.49 45.29,67.49 47.09,65.68 47.09,64.36 46.81,64.08 46.81,60.27 46.46,59.92 45.54,59.92 44.53,60.93 44.53,65.68 40.49,69.72 37.21,69.72 28.88,61.39 28.88,56.9 21.69,49.71 21.69,45.77 23.32,44.15 23.32,37.97 24.69,36.6 24.69,33.66 27.15,31.19 29.67,31.19 29.87,30.99 29.87,29.97 29.06,29.16 28.09,29.16 25.02,26.09 25.02,20.93 29.9,16.05 31.65,16.05 32.26,15.44 32.26,13.49
  pour Bottom (rank 2, no thermals): 22.96,21.77 22.28,22.45 22.28,25.55 22.28,26.37 22.5,26.59 26.16,26.59 26.19,26.57 26.39,26.37 26.39,26.06 26.39,24.89 26.29,24.79 25.15,24.79 24.94,24.59 24.94,22.12 24.54,21.72 23.01,21.72 22.99,21.74
VIN  (via drill 0.35)
  Top 0.152: v28.45,29.08 29.08,29.08 31.11,27.05 v31.11,26.42
  Bottom 0.152: IC1.10 27.8,28.82 28.07,29.08 v28.45,29.08 | v31.11,26.42 31.16,26.37 D3.3
  pour Bottom (rank 2, no thermals): 27.94,26.67 31.75,26.67 31.75,22.35 29.46,22.35 29.46,26.16 29.34,26.29 27.94,26.29 27.81,26.42 27.81,26.54
VUSB  (via drill 0.3, 0.35)
  Top 0.305: v34.92,27.91 34.87,27.97 34.87,41.83 34.29,42.42 34.29,52.45 v33.66,53.09
  Top 0.508: v42.42,53.09 42.39,53.06 v38.66,53.06
  Bottom 0.229: D3.1 33.56,26.1 34.92,27.46 v34.92,27.91
  Bottom 0.254: U4.AD2 27.94,56.14 27.94,55.75
  Bottom 0.305: U$3.1 47.77,49.66 46.99,49.66 44.45,52.2 44.45,52.94 44.31,53.09 v42.42,53.09 | D3.1 33.84,26.58
  Bottom 0.381: U2.4 44.21,26.45 C15.2 42.97,26.94 35.9,26.94 v34.92,27.91 | 27.94,55.75 28.83,54.86 28.83,54.1 29.84,53.09 v33.66,53.09 | C21.1 42.42,54.92 v42.42,53.09
  Bottom 0.406: C19.1 42.22,57.2 C21.1
  Bottom 0.508: v38.66,53.06 33.68,53.06 v33.66,53.09
XC1
  Bottom 0.152: C28.2 19.32,65.12 Y2.1 19.32,65.18 21.41,63.09 21.41,62.67 U4.B24
XC2
  Bottom 0.152: U4.A23 20.52,64.56 20.52,65.73 20.53,65.73 20.53,67.04 20.06,67.51 17.8,67.51 16.63,68.69 Y2.3 15.68,68.75 C27.2
XL1
  Bottom 0.152: U4.D2 27.64,62.06 27.79,62.2 27.79,63.22 28.7,64.14 32.49,64.14 Y3.P$1 33.96,63.68 35.18,63.68 C33.2
XL2
  Bottom 0.152: U4.F2 27.74,61.19 27.89,61.34 32.77,61.34 32.79,61.34 Y3.P$2 33.96,62.05 35.17,62.05 C32.2